# EAGLE design LEDSubMatrixHighDensity (EAGLE 9.6.2)
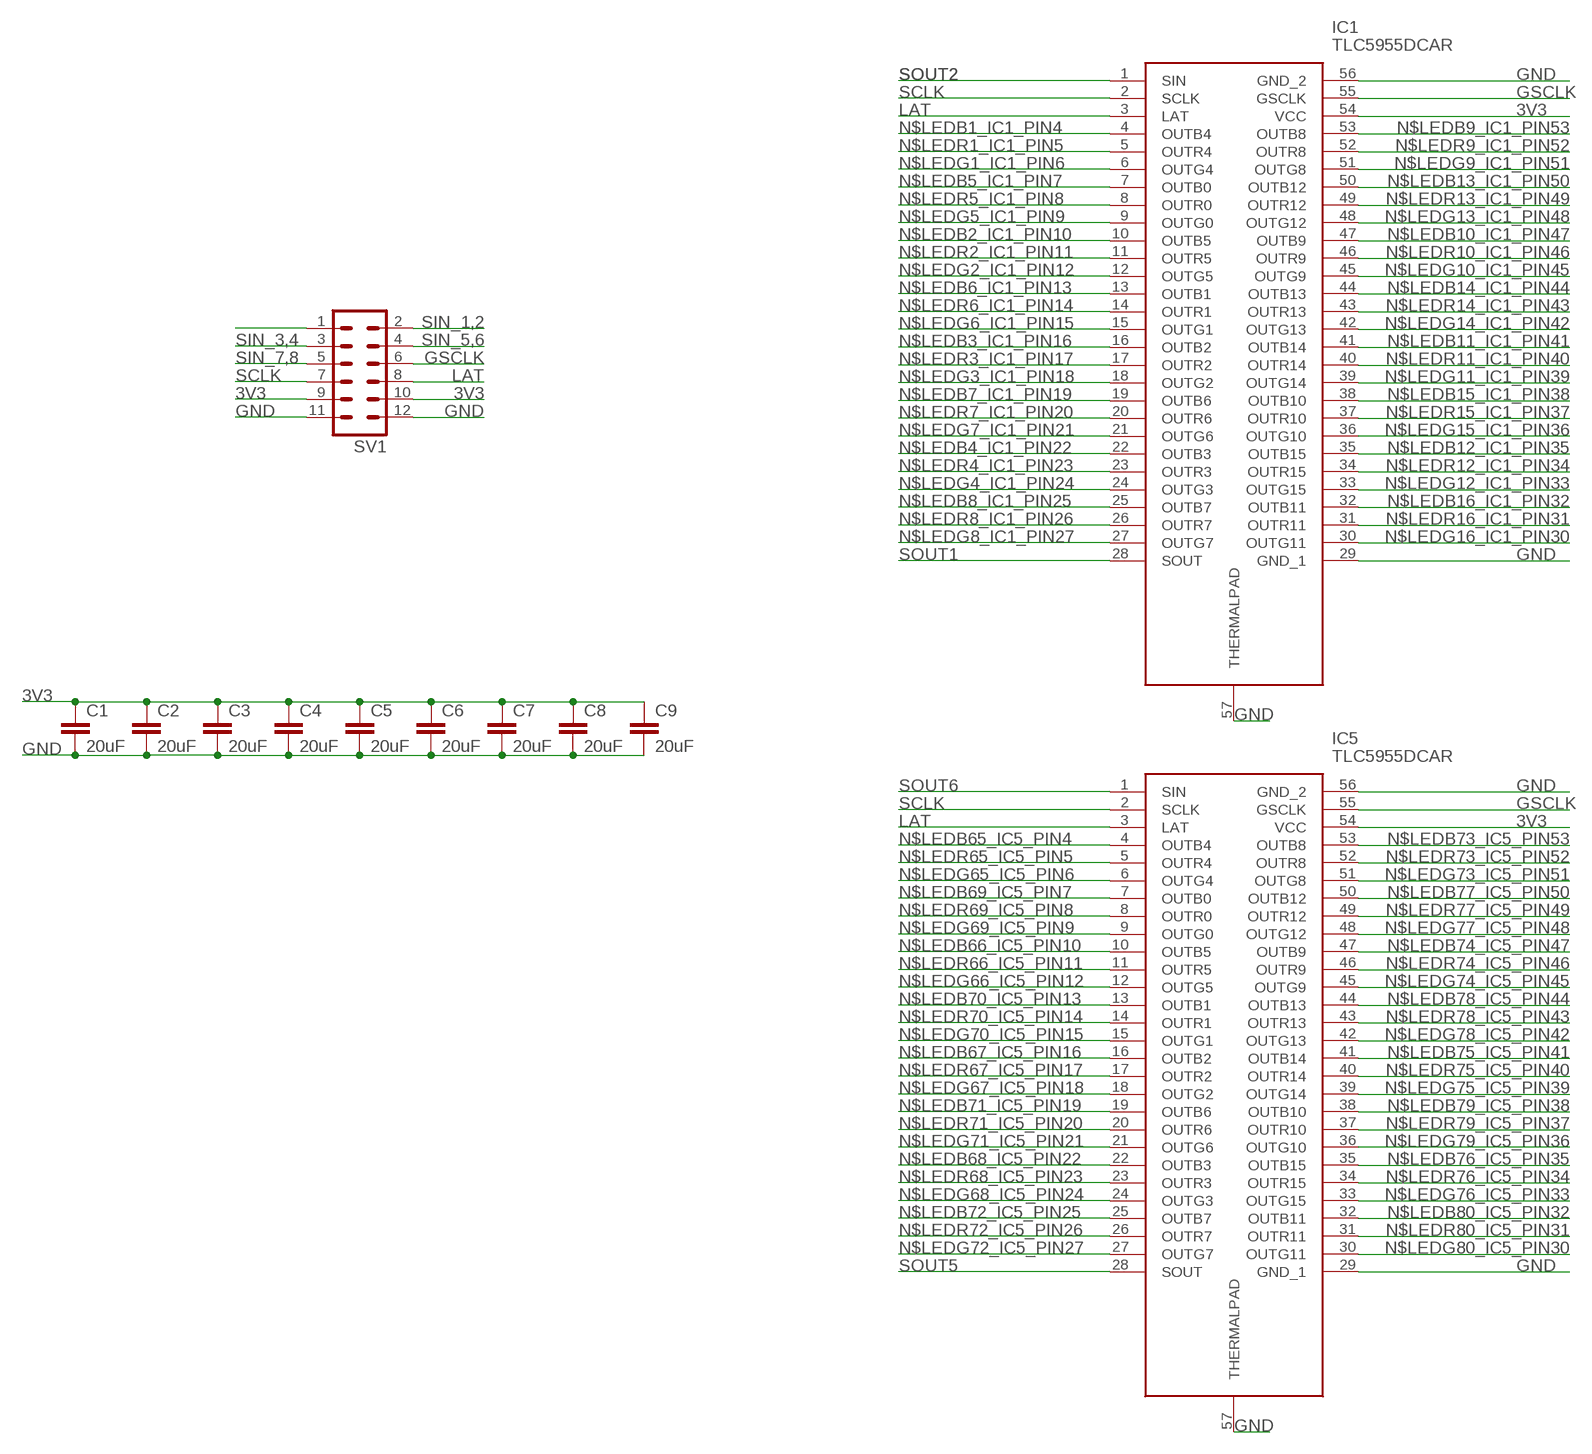
[diagram p0: schematic, sheet 1, part 1 of 3]
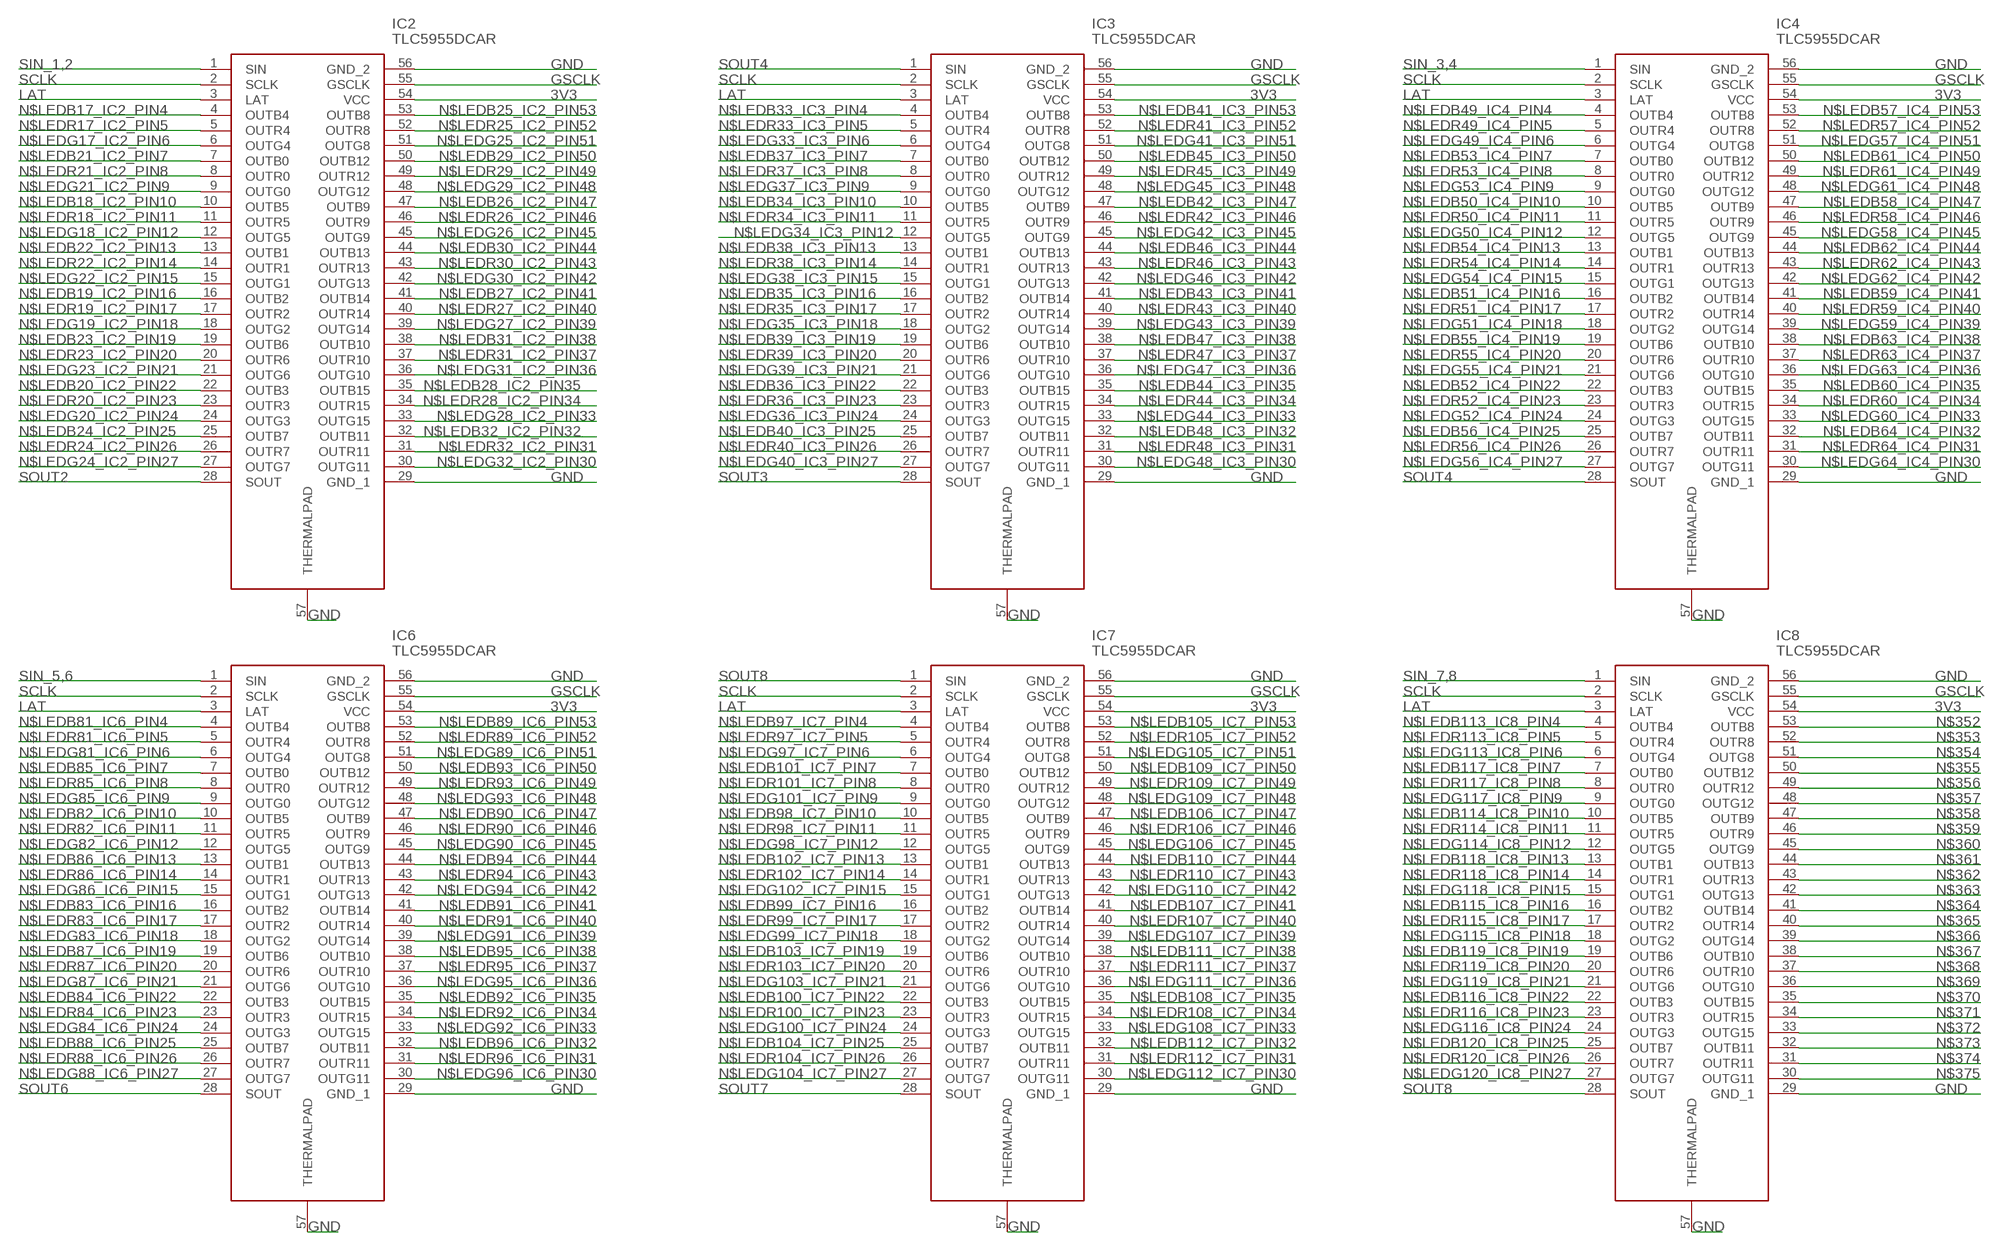
[diagram p1: schematic, sheet 1, part 2 of 3]
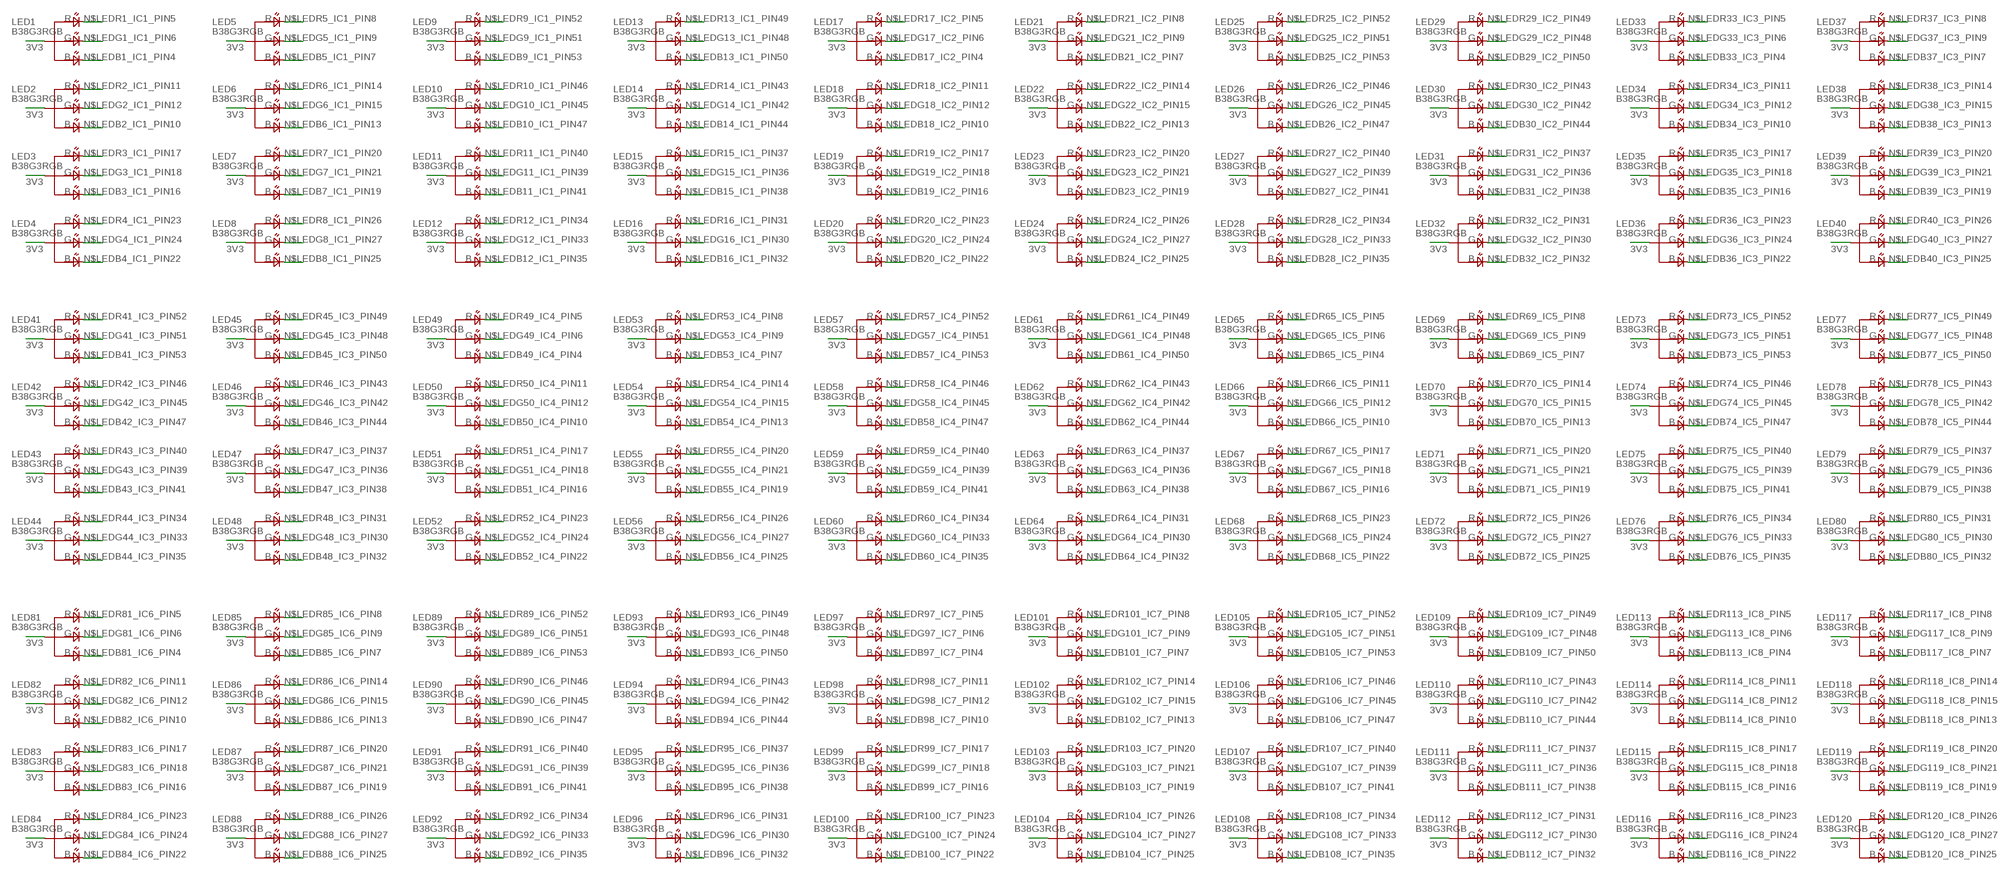
[diagram p2: schematic, sheet 1, part 3 of 3]

## Parts
C1  20uF  C-EUC0603  [C0603]
C2  20uF  C-EUC0603  [C0603]
C3  20uF  C-EUC0603  [C0603]
C4  20uF  C-EUC0603  [C0603]
C5  20uF  C-EUC0603  [C0603]
C6  20uF  C-EUC0603  [C0603]
C7  20uF  C-EUC0603  [C0603]
C8  20uF  C-EUC0603  [C0603]
C9  20uF  C-EUC0805  [C0805]
IC1  TLC5955DCAR  [SOP50P810X120-57N]
IC2  TLC5955DCAR  [SOP50P810X120-57N]
IC3  TLC5955DCAR  [SOP50P810X120-57N]
IC4  TLC5955DCAR  [SOP50P810X120-57N]
IC5  TLC5955DCAR  [SOP50P810X120-57N]
IC6  TLC5955DCAR  [SOP50P810X120-57N]
IC7  TLC5955DCAR  [SOP50P810X120-57N]
IC8  TLC5955DCAR  [SOP50P810X120-57N]
LED1  B38G3RGB  [B38G3RGB]
LED2  B38G3RGB  [B38G3RGB]
LED3  B38G3RGB  [B38G3RGB]
LED4  B38G3RGB  [B38G3RGB]
LED5  B38G3RGB  [B38G3RGB]
LED6  B38G3RGB  [B38G3RGB]
LED7  B38G3RGB  [B38G3RGB]
LED8  B38G3RGB  [B38G3RGB]
LED9  B38G3RGB  [B38G3RGB]
LED10  B38G3RGB  [B38G3RGB]
LED11  B38G3RGB  [B38G3RGB]
LED12  B38G3RGB  [B38G3RGB]
LED13  B38G3RGB  [B38G3RGB]
LED14  B38G3RGB  [B38G3RGB]
LED15  B38G3RGB  [B38G3RGB]
LED16  B38G3RGB  [B38G3RGB]
LED17  B38G3RGB  [B38G3RGB]
LED18  B38G3RGB  [B38G3RGB]
LED19  B38G3RGB  [B38G3RGB]
LED20  B38G3RGB  [B38G3RGB]
LED21  B38G3RGB  [B38G3RGB]
LED22  B38G3RGB  [B38G3RGB]
LED23  B38G3RGB  [B38G3RGB]
LED24  B38G3RGB  [B38G3RGB]
LED25  B38G3RGB  [B38G3RGB]
LED26  B38G3RGB  [B38G3RGB]
LED27  B38G3RGB  [B38G3RGB]
LED28  B38G3RGB  [B38G3RGB]
LED29  B38G3RGB  [B38G3RGB]
LED30  B38G3RGB  [B38G3RGB]
LED31  B38G3RGB  [B38G3RGB]
LED32  B38G3RGB  [B38G3RGB]
LED33  B38G3RGB  [B38G3RGB]
LED34  B38G3RGB  [B38G3RGB]
LED35  B38G3RGB  [B38G3RGB]
LED36  B38G3RGB  [B38G3RGB]
LED37  B38G3RGB  [B38G3RGB]
LED38  B38G3RGB  [B38G3RGB]
LED39  B38G3RGB  [B38G3RGB]
LED40  B38G3RGB  [B38G3RGB]
LED41  B38G3RGB  [B38G3RGB]
LED42  B38G3RGB  [B38G3RGB]
LED43  B38G3RGB  [B38G3RGB]
LED44  B38G3RGB  [B38G3RGB]
LED45  B38G3RGB  [B38G3RGB]
LED46  B38G3RGB  [B38G3RGB]
LED47  B38G3RGB  [B38G3RGB]
LED48  B38G3RGB  [B38G3RGB]
LED49  B38G3RGB  [B38G3RGB]
LED50  B38G3RGB  [B38G3RGB]
LED51  B38G3RGB  [B38G3RGB]
LED52  B38G3RGB  [B38G3RGB]
LED53  B38G3RGB  [B38G3RGB]
LED54  B38G3RGB  [B38G3RGB]
LED55  B38G3RGB  [B38G3RGB]
LED56  B38G3RGB  [B38G3RGB]
LED57  B38G3RGB  [B38G3RGB]
LED58  B38G3RGB  [B38G3RGB]
LED59  B38G3RGB  [B38G3RGB]
LED60  B38G3RGB  [B38G3RGB]
LED61  B38G3RGB  [B38G3RGB]
LED62  B38G3RGB  [B38G3RGB]
LED63  B38G3RGB  [B38G3RGB]
LED64  B38G3RGB  [B38G3RGB]
LED65  B38G3RGB  [B38G3RGB]
LED66  B38G3RGB  [B38G3RGB]
LED67  B38G3RGB  [B38G3RGB]
LED68  B38G3RGB  [B38G3RGB]
LED69  B38G3RGB  [B38G3RGB]
LED70  B38G3RGB  [B38G3RGB]
LED71  B38G3RGB  [B38G3RGB]
LED72  B38G3RGB  [B38G3RGB]
LED73  B38G3RGB  [B38G3RGB]
LED74  B38G3RGB  [B38G3RGB]
LED75  B38G3RGB  [B38G3RGB]
LED76  B38G3RGB  [B38G3RGB]
LED77  B38G3RGB  [B38G3RGB]
LED78  B38G3RGB  [B38G3RGB]
LED79  B38G3RGB  [B38G3RGB]
LED80  B38G3RGB  [B38G3RGB]
LED81  B38G3RGB  [B38G3RGB]
LED82  B38G3RGB  [B38G3RGB]
LED83  B38G3RGB  [B38G3RGB]
LED84  B38G3RGB  [B38G3RGB]
LED85  B38G3RGB  [B38G3RGB]
LED86  B38G3RGB  [B38G3RGB]
LED87  B38G3RGB  [B38G3RGB]
LED88  B38G3RGB  [B38G3RGB]
LED89  B38G3RGB  [B38G3RGB]
LED90  B38G3RGB  [B38G3RGB]
LED91  B38G3RGB  [B38G3RGB]
LED92  B38G3RGB  [B38G3RGB]
LED93  B38G3RGB  [B38G3RGB]
LED94  B38G3RGB  [B38G3RGB]
LED95  B38G3RGB  [B38G3RGB]
LED96  B38G3RGB  [B38G3RGB]
LED97  B38G3RGB  [B38G3RGB]
LED98  B38G3RGB  [B38G3RGB]
LED99  B38G3RGB  [B38G3RGB]
LED100  B38G3RGB  [B38G3RGB]
LED101  B38G3RGB  [B38G3RGB]
LED102  B38G3RGB  [B38G3RGB]
LED103  B38G3RGB  [B38G3RGB]
LED104  B38G3RGB  [B38G3RGB]
LED105  B38G3RGB  [B38G3RGB]
LED106  B38G3RGB  [B38G3RGB]
LED107  B38G3RGB  [B38G3RGB]
LED108  B38G3RGB  [B38G3RGB]
LED109  B38G3RGB  [B38G3RGB]
LED110  B38G3RGB  [B38G3RGB]
LED111  B38G3RGB  [B38G3RGB]
LED112  B38G3RGB  [B38G3RGB]
LED113  B38G3RGB  [B38G3RGB]
LED114  B38G3RGB  [B38G3RGB]
LED115  B38G3RGB  [B38G3RGB]
LED116  B38G3RGB  [B38G3RGB]
LED117  B38G3RGB  [B38G3RGB]
LED118  B38G3RGB  [B38G3RGB]
LED119  B38G3RGB  [B38G3RGB]
LED120  B38G3RGB  [B38G3RGB]
SV1  MA06-2  [MA06-2]

## Nets
3V3: C1.1 C2.1 C3.1 C4.1 C5.1 C6.1 C7.1 C8.1 C9.1 IC1.54(VCC) IC2.54(VCC) IC3.54(VCC) IC4.54(VCC) IC5.54(VCC) IC6.54(VCC) IC7.54(VCC) IC8.54(VCC) LED1.3(COM) LED2.3(COM) LED3.3(COM) LED4.3(COM) LED5.3(COM) LED6.3(COM) LED7.3(COM) LED8.3(COM) LED9.3(COM) LED10.3(COM) LED11.3(COM) LED12.3(COM) LED13.3(COM) LED14.3(COM) LED15.3(COM) LED16.3(COM) LED17.3(COM) LED18.3(COM) LED19.3(COM) LED20.3(COM) LED21.3(COM) LED22.3(COM) LED23.3(COM) LED24.3(COM) LED25.3(COM) LED26.3(COM) LED27.3(COM) LED28.3(COM) LED29.3(COM) LED30.3(COM) LED31.3(COM) LED32.3(COM) LED33.3(COM) LED34.3(COM) LED35.3(COM) LED36.3(COM) LED37.3(COM) LED38.3(COM) LED39.3(COM) LED40.3(COM) LED41.3(COM) LED42.3(COM) LED43.3(COM) LED44.3(COM) LED45.3(COM) LED46.3(COM) LED47.3(COM) LED48.3(COM) LED49.3(COM) LED50.3(COM) LED51.3(COM) LED52.3(COM) LED53.3(COM) LED54.3(COM) LED55.3(COM) LED56.3(COM) LED57.3(COM) LED58.3(COM) LED59.3(COM) LED60.3(COM) LED61.3(COM) LED62.3(COM) LED63.3(COM) LED64.3(COM) LED65.3(COM) LED66.3(COM) LED67.3(COM) LED68.3(COM) LED69.3(COM) LED70.3(COM) LED71.3(COM) LED72.3(COM) LED73.3(COM) LED74.3(COM) LED75.3(COM) LED76.3(COM) LED77.3(COM) LED78.3(COM) LED79.3(COM) LED80.3(COM) LED81.3(COM) LED82.3(COM) LED83.3(COM) LED84.3(COM) LED85.3(COM) LED86.3(COM) LED87.3(COM) LED88.3(COM) LED89.3(COM) LED90.3(COM) LED91.3(COM) LED92.3(COM) LED93.3(COM) LED94.3(COM) LED95.3(COM) LED96.3(COM) LED97.3(COM) LED98.3(COM) LED99.3(COM) LED100.3(COM) LED101.3(COM) LED102.3(COM) LED103.3(COM) LED104.3(COM) LED105.3(COM) LED106.3(COM) LED107.3(COM) LED108.3(COM) LED109.3(COM) LED110.3(COM) LED111.3(COM) LED112.3(COM) LED113.3(COM) LED114.3(COM) LED115.3(COM) LED116.3(COM) LED117.3(COM) LED118.3(COM) LED119.3(COM) LED120.3(COM) SV1.9 SV1.10
GND: C1.2 C2.2 C3.2 C4.2 C5.2 C6.2 C7.2 C8.2 C9.2 IC1.29(GND_1) IC1.56(GND_2) IC1.57(THERMALPAD) IC2.29(GND_1) IC2.56(GND_2) IC2.57(THERMALPAD) IC3.29(GND_1) IC3.56(GND_2) IC3.57(THERMALPAD) IC4.29(GND_1) IC4.56(GND_2) IC4.57(THERMALPAD) IC5.29(GND_1) IC5.56(GND_2) IC5.57(THERMALPAD) IC6.29(GND_1) IC6.56(GND_2) IC6.57(THERMALPAD) IC7.29(GND_1) IC7.56(GND_2) IC7.57(THERMALPAD) IC8.29(GND_1) IC8.56(GND_2) IC8.57(THERMALPAD) SV1.11 SV1.12
GSCLK: IC1.55(GSCLK) IC2.55(GSCLK) IC3.55(GSCLK) IC4.55(GSCLK) IC5.55(GSCLK) IC6.55(GSCLK) IC7.55(GSCLK) IC8.55(GSCLK) SV1.6
LAT: IC1.3(LAT) IC2.3(LAT) IC3.3(LAT) IC4.3(LAT) IC5.3(LAT) IC6.3(LAT) IC7.3(LAT) IC8.3(LAT) SV1.8
N$1: SV1.1
N$352: IC8.53(OUTB8)
N$353: IC8.52(OUTR8)
N$354: IC8.51(OUTG8)
N$355: IC8.50(OUTB12)
N$356: IC8.49(OUTR12)
N$357: IC8.48(OUTG12)
N$358: IC8.47(OUTB9)
N$359: IC8.46(OUTR9)
N$360: IC8.45(OUTG9)
N$361: IC8.44(OUTB13)
N$362: IC8.43(OUTR13)
N$363: IC8.42(OUTG13)
N$364: IC8.41(OUTB14)
N$365: IC8.40(OUTR14)
N$366: IC8.39(OUTG14)
N$367: IC8.38(OUTB10)
N$368: IC8.37(OUTR10)
N$369: IC8.36(OUTG10)
N$370: IC8.35(OUTB15)
N$371: IC8.34(OUTR15)
N$372: IC8.33(OUTG15)
N$373: IC8.32(OUTB11)
N$374: IC8.31(OUTR11)
N$375: IC8.30(OUTG11)
N$LEDB1_IC1_PIN4: IC1.4(OUTB4) LED1.2(BLUE)
N$LEDB2_IC1_PIN10: IC1.10(OUTB5) LED2.2(BLUE)
N$LEDB3_IC1_PIN16: IC1.16(OUTB2) LED3.2(BLUE)
N$LEDB4_IC1_PIN22: IC1.22(OUTB3) LED4.2(BLUE)
N$LEDB5_IC1_PIN7: IC1.7(OUTB0) LED5.2(BLUE)
N$LEDB6_IC1_PIN13: IC1.13(OUTB1) LED6.2(BLUE)
N$LEDB7_IC1_PIN19: IC1.19(OUTB6) LED7.2(BLUE)
N$LEDB8_IC1_PIN25: IC1.25(OUTB7) LED8.2(BLUE)
N$LEDB9_IC1_PIN53: IC1.53(OUTB8) LED9.2(BLUE)
N$LEDB10_IC1_PIN47: IC1.47(OUTB9) LED10.2(BLUE)
N$LEDB11_IC1_PIN41: IC1.41(OUTB14) LED11.2(BLUE)
N$LEDB12_IC1_PIN35: IC1.35(OUTB15) LED12.2(BLUE)
N$LEDB13_IC1_PIN50: IC1.50(OUTB12) LED13.2(BLUE)
N$LEDB14_IC1_PIN44: IC1.44(OUTB13) LED14.2(BLUE)
N$LEDB15_IC1_PIN38: IC1.38(OUTB10) LED15.2(BLUE)
N$LEDB16_IC1_PIN32: IC1.32(OUTB11) LED16.2(BLUE)
N$LEDB17_IC2_PIN4: IC2.4(OUTB4) LED17.2(BLUE)
N$LEDB18_IC2_PIN10: IC2.10(OUTB5) LED18.2(BLUE)
N$LEDB19_IC2_PIN16: IC2.16(OUTB2) LED19.2(BLUE)
N$LEDB20_IC2_PIN22: IC2.22(OUTB3) LED20.2(BLUE)
N$LEDB21_IC2_PIN7: IC2.7(OUTB0) LED21.2(BLUE)
N$LEDB22_IC2_PIN13: IC2.13(OUTB1) LED22.2(BLUE)
N$LEDB23_IC2_PIN19: IC2.19(OUTB6) LED23.2(BLUE)
N$LEDB24_IC2_PIN25: IC2.25(OUTB7) LED24.2(BLUE)
N$LEDB25_IC2_PIN53: IC2.53(OUTB8) LED25.2(BLUE)
N$LEDB26_IC2_PIN47: IC2.47(OUTB9) LED26.2(BLUE)
N$LEDB27_IC2_PIN41: IC2.41(OUTB14) LED27.2(BLUE)
N$LEDB28_IC2_PIN35: IC2.35(OUTB15) LED28.2(BLUE)
N$LEDB29_IC2_PIN50: IC2.50(OUTB12) LED29.2(BLUE)
N$LEDB30_IC2_PIN44: IC2.44(OUTB13) LED30.2(BLUE)
N$LEDB31_IC2_PIN38: IC2.38(OUTB10) LED31.2(BLUE)
N$LEDB32_IC2_PIN32: IC2.32(OUTB11) LED32.2(BLUE)
N$LEDB33_IC3_PIN4: IC3.4(OUTB4) LED33.2(BLUE)
N$LEDB34_IC3_PIN10: IC3.10(OUTB5) LED34.2(BLUE)
N$LEDB35_IC3_PIN16: IC3.16(OUTB2) LED35.2(BLUE)
N$LEDB36_IC3_PIN22: IC3.22(OUTB3) LED36.2(BLUE)
N$LEDB37_IC3_PIN7: IC3.7(OUTB0) LED37.2(BLUE)
N$LEDB38_IC3_PIN13: IC3.13(OUTB1) LED38.2(BLUE)
N$LEDB39_IC3_PIN19: IC3.19(OUTB6) LED39.2(BLUE)
N$LEDB40_IC3_PIN25: IC3.25(OUTB7) LED40.2(BLUE)
N$LEDB41_IC3_PIN53: IC3.53(OUTB8) LED41.2(BLUE)
N$LEDB42_IC3_PIN47: IC3.47(OUTB9) LED42.2(BLUE)
N$LEDB43_IC3_PIN41: IC3.41(OUTB14) LED43.2(BLUE)
N$LEDB44_IC3_PIN35: IC3.35(OUTB15) LED44.2(BLUE)
N$LEDB45_IC3_PIN50: IC3.50(OUTB12) LED45.2(BLUE)
N$LEDB46_IC3_PIN44: IC3.44(OUTB13) LED46.2(BLUE)
N$LEDB47_IC3_PIN38: IC3.38(OUTB10) LED47.2(BLUE)
N$LEDB48_IC3_PIN32: IC3.32(OUTB11) LED48.2(BLUE)
N$LEDB49_IC4_PIN4: IC4.4(OUTB4) LED49.2(BLUE)
N$LEDB50_IC4_PIN10: IC4.10(OUTB5) LED50.2(BLUE)
N$LEDB51_IC4_PIN16: IC4.16(OUTB2) LED51.2(BLUE)
N$LEDB52_IC4_PIN22: IC4.22(OUTB3) LED52.2(BLUE)
N$LEDB53_IC4_PIN7: IC4.7(OUTB0) LED53.2(BLUE)
N$LEDB54_IC4_PIN13: IC4.13(OUTB1) LED54.2(BLUE)
N$LEDB55_IC4_PIN19: IC4.19(OUTB6) LED55.2(BLUE)
N$LEDB56_IC4_PIN25: IC4.25(OUTB7) LED56.2(BLUE)
N$LEDB57_IC4_PIN53: IC4.53(OUTB8) LED57.2(BLUE)
N$LEDB58_IC4_PIN47: IC4.47(OUTB9) LED58.2(BLUE)
N$LEDB59_IC4_PIN41: IC4.41(OUTB14) LED59.2(BLUE)
N$LEDB60_IC4_PIN35: IC4.35(OUTB15) LED60.2(BLUE)
N$LEDB61_IC4_PIN50: IC4.50(OUTB12) LED61.2(BLUE)
N$LEDB62_IC4_PIN44: IC4.44(OUTB13) LED62.2(BLUE)
N$LEDB63_IC4_PIN38: IC4.38(OUTB10) LED63.2(BLUE)
N$LEDB64_IC4_PIN32: IC4.32(OUTB11) LED64.2(BLUE)
N$LEDB65_IC5_PIN4: IC5.4(OUTB4) LED65.2(BLUE)
N$LEDB66_IC5_PIN10: IC5.10(OUTB5) LED66.2(BLUE)
N$LEDB67_IC5_PIN16: IC5.16(OUTB2) LED67.2(BLUE)
N$LEDB68_IC5_PIN22: IC5.22(OUTB3) LED68.2(BLUE)
N$LEDB69_IC5_PIN7: IC5.7(OUTB0) LED69.2(BLUE)
N$LEDB70_IC5_PIN13: IC5.13(OUTB1) LED70.2(BLUE)
N$LEDB71_IC5_PIN19: IC5.19(OUTB6) LED71.2(BLUE)
N$LEDB72_IC5_PIN25: IC5.25(OUTB7) LED72.2(BLUE)
N$LEDB73_IC5_PIN53: IC5.53(OUTB8) LED73.2(BLUE)
N$LEDB74_IC5_PIN47: IC5.47(OUTB9) LED74.2(BLUE)
N$LEDB75_IC5_PIN41: IC5.41(OUTB14) LED75.2(BLUE)
N$LEDB76_IC5_PIN35: IC5.35(OUTB15) LED76.2(BLUE)
N$LEDB77_IC5_PIN50: IC5.50(OUTB12) LED77.2(BLUE)
N$LEDB78_IC5_PIN44: IC5.44(OUTB13) LED78.2(BLUE)
N$LEDB79_IC5_PIN38: IC5.38(OUTB10) LED79.2(BLUE)
N$LEDB80_IC5_PIN32: IC5.32(OUTB11) LED80.2(BLUE)
N$LEDB81_IC6_PIN4: IC6.4(OUTB4) LED81.2(BLUE)
N$LEDB82_IC6_PIN10: IC6.10(OUTB5) LED82.2(BLUE)
N$LEDB83_IC6_PIN16: IC6.16(OUTB2) LED83.2(BLUE)
N$LEDB84_IC6_PIN22: IC6.22(OUTB3) LED84.2(BLUE)
N$LEDB85_IC6_PIN7: IC6.7(OUTB0) LED85.2(BLUE)
N$LEDB86_IC6_PIN13: IC6.13(OUTB1) LED86.2(BLUE)
N$LEDB87_IC6_PIN19: IC6.19(OUTB6) LED87.2(BLUE)
N$LEDB88_IC6_PIN25: IC6.25(OUTB7) LED88.2(BLUE)
N$LEDB89_IC6_PIN53: IC6.53(OUTB8) LED89.2(BLUE)
N$LEDB90_IC6_PIN47: IC6.47(OUTB9) LED90.2(BLUE)
N$LEDB91_IC6_PIN41: IC6.41(OUTB14) LED91.2(BLUE)
N$LEDB92_IC6_PIN35: IC6.35(OUTB15) LED92.2(BLUE)
N$LEDB93_IC6_PIN50: IC6.50(OUTB12) LED93.2(BLUE)
N$LEDB94_IC6_PIN44: IC6.44(OUTB13) LED94.2(BLUE)
N$LEDB95_IC6_PIN38: IC6.38(OUTB10) LED95.2(BLUE)
N$LEDB96_IC6_PIN32: IC6.32(OUTB11) LED96.2(BLUE)
N$LEDB97_IC7_PIN4: IC7.4(OUTB4) LED97.2(BLUE)
N$LEDB98_IC7_PIN10: IC7.10(OUTB5) LED98.2(BLUE)
N$LEDB99_IC7_PIN16: IC7.16(OUTB2) LED99.2(BLUE)
N$LEDB100_IC7_PIN22: IC7.22(OUTB3) LED100.2(BLUE)
N$LEDB101_IC7_PIN7: IC7.7(OUTB0) LED101.2(BLUE)
N$LEDB102_IC7_PIN13: IC7.13(OUTB1) LED102.2(BLUE)
N$LEDB103_IC7_PIN19: IC7.19(OUTB6) LED103.2(BLUE)
N$LEDB104_IC7_PIN25: IC7.25(OUTB7) LED104.2(BLUE)
N$LEDB105_IC7_PIN53: IC7.53(OUTB8) LED105.2(BLUE)
N$LEDB106_IC7_PIN47: IC7.47(OUTB9) LED106.2(BLUE)
N$LEDB107_IC7_PIN41: IC7.41(OUTB14) LED107.2(BLUE)
N$LEDB108_IC7_PIN35: IC7.35(OUTB15) LED108.2(BLUE)
N$LEDB109_IC7_PIN50: IC7.50(OUTB12) LED109.2(BLUE)
N$LEDB110_IC7_PIN44: IC7.44(OUTB13) LED110.2(BLUE)
N$LEDB111_IC7_PIN38: IC7.38(OUTB10) LED111.2(BLUE)
N$LEDB112_IC7_PIN32: IC7.32(OUTB11) LED112.2(BLUE)
N$LEDB113_IC8_PIN4: IC8.4(OUTB4) LED113.2(BLUE)
N$LEDB114_IC8_PIN10: IC8.10(OUTB5) LED114.2(BLUE)
N$LEDB115_IC8_PIN16: IC8.16(OUTB2) LED115.2(BLUE)
N$LEDB116_IC8_PIN22: IC8.22(OUTB3) LED116.2(BLUE)
N$LEDB117_IC8_PIN7: IC8.7(OUTB0) LED117.2(BLUE)
N$LEDB118_IC8_PIN13: IC8.13(OUTB1) LED118.2(BLUE)
N$LEDB119_IC8_PIN19: IC8.19(OUTB6) LED119.2(BLUE)
N$LEDB120_IC8_PIN25: IC8.25(OUTB7) LED120.2(BLUE)
N$LEDG1_IC1_PIN6: IC1.6(OUTG4) LED1.1(GREEN)
N$LEDG2_IC1_PIN12: IC1.12(OUTG5) LED2.1(GREEN)
N$LEDG3_IC1_PIN18: IC1.18(OUTG2) LED3.1(GREEN)
N$LEDG4_IC1_PIN24: IC1.24(OUTG3) LED4.1(GREEN)
N$LEDG5_IC1_PIN9: IC1.9(OUTG0) LED5.1(GREEN)
N$LEDG6_IC1_PIN15: IC1.15(OUTG1) LED6.1(GREEN)
N$LEDG7_IC1_PIN21: IC1.21(OUTG6) LED7.1(GREEN)
N$LEDG8_IC1_PIN27: IC1.27(OUTG7) LED8.1(GREEN)
N$LEDG9_IC1_PIN51: IC1.51(OUTG8) LED9.1(GREEN)
N$LEDG10_IC1_PIN45: IC1.45(OUTG9) LED10.1(GREEN)
N$LEDG11_IC1_PIN39: IC1.39(OUTG14) LED11.1(GREEN)
N$LEDG12_IC1_PIN33: IC1.33(OUTG15) LED12.1(GREEN)
N$LEDG13_IC1_PIN48: IC1.48(OUTG12) LED13.1(GREEN)
N$LEDG14_IC1_PIN42: IC1.42(OUTG13) LED14.1(GREEN)
N$LEDG15_IC1_PIN36: IC1.36(OUTG10) LED15.1(GREEN)
N$LEDG16_IC1_PIN30: IC1.30(OUTG11) LED16.1(GREEN)
N$LEDG17_IC2_PIN6: IC2.6(OUTG4) LED17.1(GREEN)
N$LEDG18_IC2_PIN12: IC2.12(OUTG5) LED18.1(GREEN)
N$LEDG19_IC2_PIN18: IC2.18(OUTG2) LED19.1(GREEN)
N$LEDG20_IC2_PIN24: IC2.24(OUTG3) LED20.1(GREEN)
N$LEDG21_IC2_PIN9: IC2.9(OUTG0) LED21.1(GREEN)
N$LEDG22_IC2_PIN15: IC2.15(OUTG1) LED22.1(GREEN)
N$LEDG23_IC2_PIN21: IC2.21(OUTG6) LED23.1(GREEN)
N$LEDG24_IC2_PIN27: IC2.27(OUTG7) LED24.1(GREEN)
N$LEDG25_IC2_PIN51: IC2.51(OUTG8) LED25.1(GREEN)
N$LEDG26_IC2_PIN45: IC2.45(OUTG9) LED26.1(GREEN)
N$LEDG27_IC2_PIN39: IC2.39(OUTG14) LED27.1(GREEN)
N$LEDG28_IC2_PIN33: IC2.33(OUTG15) LED28.1(GREEN)
N$LEDG29_IC2_PIN48: IC2.48(OUTG12) LED29.1(GREEN)
N$LEDG30_IC2_PIN42: IC2.42(OUTG13) LED30.1(GREEN)
N$LEDG31_IC2_PIN36: IC2.36(OUTG10) LED31.1(GREEN)
N$LEDG32_IC2_PIN30: IC2.30(OUTG11) LED32.1(GREEN)
N$LEDG33_IC3_PIN6: IC3.6(OUTG4) LED33.1(GREEN)
N$LEDG34_IC3_PIN12: IC3.12(OUTG5) LED34.1(GREEN)
N$LEDG35_IC3_PIN18: IC3.18(OUTG2) LED35.1(GREEN)
N$LEDG36_IC3_PIN24: IC3.24(OUTG3) LED36.1(GREEN)
N$LEDG37_IC3_PIN9: IC3.9(OUTG0) LED37.1(GREEN)
N$LEDG38_IC3_PIN15: IC3.15(OUTG1) LED38.1(GREEN)
N$LEDG39_IC3_PIN21: IC3.21(OUTG6) LED39.1(GREEN)
N$LEDG40_IC3_PIN27: IC3.27(OUTG7) LED40.1(GREEN)
N$LEDG41_IC3_PIN51: IC3.51(OUTG8) LED41.1(GREEN)
N$LEDG42_IC3_PIN45: IC3.45(OUTG9) LED42.1(GREEN)
N$LEDG43_IC3_PIN39: IC3.39(OUTG14) LED43.1(GREEN)
N$LEDG44_IC3_PIN33: IC3.33(OUTG15) LED44.1(GREEN)
N$LEDG45_IC3_PIN48: IC3.48(OUTG12) LED45.1(GREEN)
N$LEDG46_IC3_PIN42: IC3.42(OUTG13) LED46.1(GREEN)
N$LEDG47_IC3_PIN36: IC3.36(OUTG10) LED47.1(GREEN)
N$LEDG48_IC3_PIN30: IC3.30(OUTG11) LED48.1(GREEN)
N$LEDG49_IC4_PIN6: IC4.6(OUTG4) LED49.1(GREEN)
N$LEDG50_IC4_PIN12: IC4.12(OUTG5) LED50.1(GREEN)
N$LEDG51_IC4_PIN18: IC4.18(OUTG2) LED51.1(GREEN)
N$LEDG52_IC4_PIN24: IC4.24(OUTG3) LED52.1(GREEN)
N$LEDG53_IC4_PIN9: IC4.9(OUTG0) LED53.1(GREEN)
N$LEDG54_IC4_PIN15: IC4.15(OUTG1) LED54.1(GREEN)
N$LEDG55_IC4_PIN21: IC4.21(OUTG6) LED55.1(GREEN)
N$LEDG56_IC4_PIN27: IC4.27(OUTG7) LED56.1(GREEN)
N$LEDG57_IC4_PIN51: IC4.51(OUTG8) LED57.1(GREEN)
N$LEDG58_IC4_PIN45: IC4.45(OUTG9) LED58.1(GREEN)
N$LEDG59_IC4_PIN39: IC4.39(OUTG14) LED59.1(GREEN)
N$LEDG60_IC4_PIN33: IC4.33(OUTG15) LED60.1(GREEN)
N$LEDG61_IC4_PIN48: IC4.48(OUTG12) LED61.1(GREEN)
N$LEDG62_IC4_PIN42: IC4.42(OUTG13) LED62.1(GREEN)
N$LEDG63_IC4_PIN36: IC4.36(OUTG10) LED63.1(GREEN)
N$LEDG64_IC4_PIN30: IC4.30(OUTG11) LED64.1(GREEN)
N$LEDG65_IC5_PIN6: IC5.6(OUTG4) LED65.1(GREEN)
N$LEDG66_IC5_PIN12: IC5.12(OUTG5) LED66.1(GREEN)
N$LEDG67_IC5_PIN18: IC5.18(OUTG2) LED67.1(GREEN)
N$LEDG68_IC5_PIN24: IC5.24(OUTG3) LED68.1(GREEN)
N$LEDG69_IC5_PIN9: IC5.9(OUTG0) LED69.1(GREEN)
N$LEDG70_IC5_PIN15: IC5.15(OUTG1) LED70.1(GREEN)
N$LEDG71_IC5_PIN21: IC5.21(OUTG6) LED71.1(GREEN)
N$LEDG72_IC5_PIN27: IC5.27(OUTG7) LED72.1(GREEN)
N$LEDG73_IC5_PIN51: IC5.51(OUTG8) LED73.1(GREEN)
N$LEDG74_IC5_PIN45: IC5.45(OUTG9) LED74.1(GREEN)
N$LEDG75_IC5_PIN39: IC5.39(OUTG14) LED75.1(GREEN)
N$LEDG76_IC5_PIN33: IC5.33(OUTG15) LED76.1(GREEN)
N$LEDG77_IC5_PIN48: IC5.48(OUTG12) LED77.1(GREEN)
N$LEDG78_IC5_PIN42: IC5.42(OUTG13) LED78.1(GREEN)
N$LEDG79_IC5_PIN36: IC5.36(OUTG10) LED79.1(GREEN)
N$LEDG80_IC5_PIN30: IC5.30(OUTG11) LED80.1(GREEN)
N$LEDG81_IC6_PIN6: IC6.6(OUTG4) LED81.1(GREEN)
N$LEDG82_IC6_PIN12: IC6.12(OUTG5) LED82.1(GREEN)
N$LEDG83_IC6_PIN18: IC6.18(OUTG2) LED83.1(GREEN)
N$LEDG84_IC6_PIN24: IC6.24(OUTG3) LED84.1(GREEN)
N$LEDG85_IC6_PIN9: IC6.9(OUTG0) LED85.1(GREEN)
N$LEDG86_IC6_PIN15: IC6.15(OUTG1) LED86.1(GREEN)
N$LEDG87_IC6_PIN21: IC6.21(OUTG6) LED87.1(GREEN)
N$LEDG88_IC6_PIN27: IC6.27(OUTG7) LED88.1(GREEN)
N$LEDG89_IC6_PIN51: IC6.51(OUTG8) LED89.1(GREEN)
N$LEDG90_IC6_PIN45: IC6.45(OUTG9) LED90.1(GREEN)
N$LEDG91_IC6_PIN39: IC6.39(OUTG14) LED91.1(GREEN)
N$LEDG92_IC6_PIN33: IC6.33(OUTG15) LED92.1(GREEN)
N$LEDG93_IC6_PIN48: IC6.48(OUTG12) LED93.1(GREEN)
N$LEDG94_IC6_PIN42: IC6.42(OUTG13) LED94.1(GREEN)
N$LEDG95_IC6_PIN36: IC6.36(OUTG10) LED95.1(GREEN)
N$LEDG96_IC6_PIN30: IC6.30(OUTG11) LED96.1(GREEN)
N$LEDG97_IC7_PIN6: IC7.6(OUTG4) LED97.1(GREEN)
N$LEDG98_IC7_PIN12: IC7.12(OUTG5) LED98.1(GREEN)
N$LEDG99_IC7_PIN18: IC7.18(OUTG2) LED99.1(GREEN)
N$LEDG100_IC7_PIN24: IC7.24(OUTG3) LED100.1(GREEN)
N$LEDG101_IC7_PIN9: IC7.9(OUTG0) LED101.1(GREEN)
N$LEDG102_IC7_PIN15: IC7.15(OUTG1) LED102.1(GREEN)
N$LEDG103_IC7_PIN21: IC7.21(OUTG6) LED103.1(GREEN)
N$LEDG104_IC7_PIN27: IC7.27(OUTG7) LED104.1(GREEN)
N$LEDG105_IC7_PIN51: IC7.51(OUTG8) LED105.1(GREEN)
N$LEDG106_IC7_PIN45: IC7.45(OUTG9) LED106.1(GREEN)
N$LEDG107_IC7_PIN39: IC7.39(OUTG14) LED107.1(GREEN)
N$LEDG108_IC7_PIN33: IC7.33(OUTG15) LED108.1(GREEN)
N$LEDG109_IC7_PIN48: IC7.48(OUTG12) LED109.1(GREEN)
N$LEDG110_IC7_PIN42: IC7.42(OUTG13) LED110.1(GREEN)
N$LEDG111_IC7_PIN36: IC7.36(OUTG10) LED111.1(GREEN)
N$LEDG112_IC7_PIN30: IC7.30(OUTG11) LED112.1(GREEN)
N$LEDG113_IC8_PIN6: IC8.6(OUTG4) LED113.1(GREEN)
N$LEDG114_IC8_PIN12: IC8.12(OUTG5) LED114.1(GREEN)
N$LEDG115_IC8_PIN18: IC8.18(OUTG2) LED115.1(GREEN)
N$LEDG116_IC8_PIN24: IC8.24(OUTG3) LED116.1(GREEN)
N$LEDG117_IC8_PIN9: IC8.9(OUTG0) LED117.1(GREEN)
N$LEDG118_IC8_PIN15: IC8.15(OUTG1) LED118.1(GREEN)
N$LEDG119_IC8_PIN21: IC8.21(OUTG6) LED119.1(GREEN)
N$LEDG120_IC8_PIN27: IC8.27(OUTG7) LED120.1(GREEN)
N$LEDR1_IC1_PIN5: IC1.5(OUTR4) LED1.4(RED)
N$LEDR2_IC1_PIN11: IC1.11(OUTR5) LED2.4(RED)
N$LEDR3_IC1_PIN17: IC1.17(OUTR2) LED3.4(RED)
N$LEDR4_IC1_PIN23: IC1.23(OUTR3) LED4.4(RED)
N$LEDR5_IC1_PIN8: IC1.8(OUTR0) LED5.4(RED)
N$LEDR6_IC1_PIN14: IC1.14(OUTR1) LED6.4(RED)
N$LEDR7_IC1_PIN20: IC1.20(OUTR6) LED7.4(RED)
N$LEDR8_IC1_PIN26: IC1.26(OUTR7) LED8.4(RED)
N$LEDR9_IC1_PIN52: IC1.52(OUTR8) LED9.4(RED)
N$LEDR10_IC1_PIN46: IC1.46(OUTR9) LED10.4(RED)
N$LEDR11_IC1_PIN40: IC1.40(OUTR14) LED11.4(RED)
N$LEDR12_IC1_PIN34: IC1.34(OUTR15) LED12.4(RED)
N$LEDR13_IC1_PIN49: IC1.49(OUTR12) LED13.4(RED)
N$LEDR14_IC1_PIN43: IC1.43(OUTR13) LED14.4(RED)
N$LEDR15_IC1_PIN37: IC1.37(OUTR10) LED15.4(RED)
N$LEDR16_IC1_PIN31: IC1.31(OUTR11) LED16.4(RED)
N$LEDR17_IC2_PIN5: IC2.5(OUTR4) LED17.4(RED)
N$LEDR18_IC2_PIN11: IC2.11(OUTR5) LED18.4(RED)
N$LEDR19_IC2_PIN17: IC2.17(OUTR2) LED19.4(RED)
N$LEDR20_IC2_PIN23: IC2.23(OUTR3) LED20.4(RED)
N$LEDR21_IC2_PIN8: IC2.8(OUTR0) LED21.4(RED)
N$LEDR22_IC2_PIN14: IC2.14(OUTR1) LED22.4(RED)
N$LEDR23_IC2_PIN20: IC2.20(OUTR6) LED23.4(RED)
N$LEDR24_IC2_PIN26: IC2.26(OUTR7) LED24.4(RED)
N$LEDR25_IC2_PIN52: IC2.52(OUTR8) LED25.4(RED)
N$LEDR26_IC2_PIN46: IC2.46(OUTR9) LED26.4(RED)
N$LEDR27_IC2_PIN40: IC2.40(OUTR14) LED27.4(RED)
N$LEDR28_IC2_PIN34: IC2.34(OUTR15) LED28.4(RED)
N$LEDR29_IC2_PIN49: IC2.49(OUTR12) LED29.4(RED)
N$LEDR30_IC2_PIN43: IC2.43(OUTR13) LED30.4(RED)
N$LEDR31_IC2_PIN37: IC2.37(OUTR10) LED31.4(RED)
N$LEDR32_IC2_PIN31: IC2.31(OUTR11) LED32.4(RED)
N$LEDR33_IC3_PIN5: IC3.5(OUTR4) LED33.4(RED)
N$LEDR34_IC3_PIN11: IC3.11(OUTR5) LED34.4(RED)
N$LEDR35_IC3_PIN17: IC3.17(OUTR2) LED35.4(RED)
N$LEDR36_IC3_PIN23: IC3.23(OUTR3) LED36.4(RED)
N$LEDR37_IC3_PIN8: IC3.8(OUTR0) LED37.4(RED)
N$LEDR38_IC3_PIN14: IC3.14(OUTR1) LED38.4(RED)
N$LEDR39_IC3_PIN20: IC3.20(OUTR6) LED39.4(RED)
N$LEDR40_IC3_PIN26: IC3.26(OUTR7) LED40.4(RED)
N$LEDR41_IC3_PIN52: IC3.52(OUTR8) LED41.4(RED)
N$LEDR42_IC3_PIN46: IC3.46(OUTR9) LED42.4(RED)
N$LEDR43_IC3_PIN40: IC3.40(OUTR14) LED43.4(RED)
N$LEDR44_IC3_PIN34: IC3.34(OUTR15) LED44.4(RED)
N$LEDR45_IC3_PIN49: IC3.49(OUTR12) LED45.4(RED)
N$LEDR46_IC3_PIN43: IC3.43(OUTR13) LED46.4(RED)
N$LEDR47_IC3_PIN37: IC3.37(OUTR10) LED47.4(RED)
N$LEDR48_IC3_PIN31: IC3.31(OUTR11) LED48.4(RED)
N$LEDR49_IC4_PIN5: IC4.5(OUTR4) LED49.4(RED)
N$LEDR50_IC4_PIN11: IC4.11(OUTR5) LED50.4(RED)
N$LEDR51_IC4_PIN17: IC4.17(OUTR2) LED51.4(RED)
N$LEDR52_IC4_PIN23: IC4.23(OUTR3) LED52.4(RED)
N$LEDR53_IC4_PIN8: IC4.8(OUTR0) LED53.4(RED)
N$LEDR54_IC4_PIN14: IC4.14(OUTR1) LED54.4(RED)
N$LEDR55_IC4_PIN20: IC4.20(OUTR6) LED55.4(RED)
N$LEDR56_IC4_PIN26: IC4.26(OUTR7) LED56.4(RED)
N$LEDR57_IC4_PIN52: IC4.52(OUTR8) LED57.4(RED)
N$LEDR58_IC4_PIN46: IC4.46(OUTR9) LED58.4(RED)
N$LEDR59_IC4_PIN40: IC4.40(OUTR14) LED59.4(RED)
N$LEDR60_IC4_PIN34: IC4.34(OUTR15) LED60.4(RED)
N$LEDR61_IC4_PIN49: IC4.49(OUTR12) LED61.4(RED)
N$LEDR62_IC4_PIN43: IC4.43(OUTR13) LED62.4(RED)
N$LEDR63_IC4_PIN37: IC4.37(OUTR10) LED63.4(RED)
N$LEDR64_IC4_PIN31: IC4.31(OUTR11) LED64.4(RED)
N$LEDR65_IC5_PIN5: IC5.5(OUTR4) LED65.4(RED)
N$LEDR66_IC5_PIN11: IC5.11(OUTR5) LED66.4(RED)
N$LEDR67_IC5_PIN17: IC5.17(OUTR2) LED67.4(RED)
N$LEDR68_IC5_PIN23: IC5.23(OUTR3) LED68.4(RED)
N$LEDR69_IC5_PIN8: IC5.8(OUTR0) LED69.4(RED)
N$LEDR70_IC5_PIN14: IC5.14(OUTR1) LED70.4(RED)
N$LEDR71_IC5_PIN20: IC5.20(OUTR6) LED71.4(RED)
N$LEDR72_IC5_PIN26: IC5.26(OUTR7) LED72.4(RED)
N$LEDR73_IC5_PIN52: IC5.52(OUTR8) LED73.4(RED)
N$LEDR74_IC5_PIN46: IC5.46(OUTR9) LED74.4(RED)
N$LEDR75_IC5_PIN40: IC5.40(OUTR14) LED75.4(RED)
N$LEDR76_IC5_PIN34: IC5.34(OUTR15) LED76.4(RED)
N$LEDR77_IC5_PIN49: IC5.49(OUTR12) LED77.4(RED)
N$LEDR78_IC5_PIN43: IC5.43(OUTR13) LED78.4(RED)
N$LEDR79_IC5_PIN37: IC5.37(OUTR10) LED79.4(RED)
N$LEDR80_IC5_PIN31: IC5.31(OUTR11) LED80.4(RED)
N$LEDR81_IC6_PIN5: IC6.5(OUTR4) LED81.4(RED)
N$LEDR82_IC6_PIN11: IC6.11(OUTR5) LED82.4(RED)
N$LEDR83_IC6_PIN17: IC6.17(OUTR2) LED83.4(RED)
N$LEDR84_IC6_PIN23: IC6.23(OUTR3) LED84.4(RED)
N$LEDR85_IC6_PIN8: IC6.8(OUTR0) LED85.4(RED)
N$LEDR86_IC6_PIN14: IC6.14(OUTR1) LED86.4(RED)
N$LEDR87_IC6_PIN20: IC6.20(OUTR6) LED87.4(RED)
N$LEDR88_IC6_PIN26: IC6.26(OUTR7) LED88.4(RED)
N$LEDR89_IC6_PIN52: IC6.52(OUTR8) LED89.4(RED)
N$LEDR90_IC6_PIN46: IC6.46(OUTR9) LED90.4(RED)
N$LEDR91_IC6_PIN40: IC6.40(OUTR14) LED91.4(RED)
N$LEDR92_IC6_PIN34: IC6.34(OUTR15) LED92.4(RED)
N$LEDR93_IC6_PIN49: IC6.49(OUTR12) LED93.4(RED)
N$LEDR94_IC6_PIN43: IC6.43(OUTR13) LED94.4(RED)
N$LEDR95_IC6_PIN37: IC6.37(OUTR10) LED95.4(RED)
N$LEDR96_IC6_PIN31: IC6.31(OUTR11) LED96.4(RED)
N$LEDR97_IC7_PIN5: IC7.5(OUTR4) LED97.4(RED)
N$LEDR98_IC7_PIN11: IC7.11(OUTR5) LED98.4(RED)
N$LEDR99_IC7_PIN17: IC7.17(OUTR2) LED99.4(RED)
N$LEDR100_IC7_PIN23: IC7.23(OUTR3) LED100.4(RED)
N$LEDR101_IC7_PIN8: IC7.8(OUTR0) LED101.4(RED)
N$LEDR102_IC7_PIN14: IC7.14(OUTR1) LED102.4(RED)
N$LEDR103_IC7_PIN20: IC7.20(OUTR6) LED103.4(RED)
N$LEDR104_IC7_PIN26: IC7.26(OUTR7) LED104.4(RED)
N$LEDR105_IC7_PIN52: IC7.52(OUTR8) LED105.4(RED)
N$LEDR106_IC7_PIN46: IC7.46(OUTR9) LED106.4(RED)
N$LEDR107_IC7_PIN40: IC7.40(OUTR14) LED107.4(RED)
N$LEDR108_IC7_PIN34: IC7.34(OUTR15) LED108.4(RED)
N$LEDR109_IC7_PIN49: IC7.49(OUTR12) LED109.4(RED)
N$LEDR110_IC7_PIN43: IC7.43(OUTR13) LED110.4(RED)
N$LEDR111_IC7_PIN37: IC7.37(OUTR10) LED111.4(RED)
N$LEDR112_IC7_PIN31: IC7.31(OUTR11) LED112.4(RED)
N$LEDR113_IC8_PIN5: IC8.5(OUTR4) LED113.4(RED)
N$LEDR114_IC8_PIN11: IC8.11(OUTR5) LED114.4(RED)
N$LEDR115_IC8_PIN17: IC8.17(OUTR2) LED115.4(RED)
N$LEDR116_IC8_PIN23: IC8.23(OUTR3) LED116.4(RED)
N$LEDR117_IC8_PIN8: IC8.8(OUTR0) LED117.4(RED)
N$LEDR118_IC8_PIN14: IC8.14(OUTR1) LED118.4(RED)
N$LEDR119_IC8_PIN20: IC8.20(OUTR6) LED119.4(RED)
N$LEDR120_IC8_PIN26: IC8.26(OUTR7) LED120.4(RED)
SCLK: IC1.2(SCLK) IC2.2(SCLK) IC3.2(SCLK) IC4.2(SCLK) IC5.2(SCLK) IC6.2(SCLK) IC7.2(SCLK) IC8.2(SCLK) SV1.7
SIN_1,2: IC2.1(SIN) SV1.2
SIN_3,4: IC4.1(SIN) SV1.3
SIN_5,6: IC6.1(SIN) SV1.4
SIN_7,8: IC8.1(SIN) SV1.5
SOUT1: IC1.28(SOUT)
SOUT2: IC1.1(SIN) IC2.28(SOUT)
SOUT3: IC3.28(SOUT)
SOUT4: IC3.1(SIN) IC4.28(SOUT)
SOUT5: IC5.28(SOUT)
SOUT6: IC5.1(SIN) IC6.28(SOUT)
SOUT7: IC7.28(SOUT)
SOUT8: IC7.1(SIN) IC8.28(SOUT)

## Library data of the parts
C1-C9 = rcl:C-EU: CAPACITOR, European symbol; SPICEPREFIX: C
IC1-IC8 = TLC5955DCAR:TLC5955DCAR: 48ch, 16bit PWM LED Driver with Dot-Correction, Brightness Control, Open/Short Detection Source: Datasheet <http://www.ti.com/lit/ds/symlink/tlc5955.pdf>; ARROW_PART_NUMBER: TLC5955DCAR; ARROW_PRICE-STOCK: https://www.arrow.com/en/products/tlc5955dcar/texas-instruments; DESCRIPTION: 48ch, 16bit PWM LED Driver with Dot-Correction, Brightness Control, Open/Short Detection; HEIGHT: 1.2mm; MANUFACTURER_NAME: Texas Instruments; MANUFACTURER_PART_NUMBER: TLC5955DCAR; MOUSER_PART_NUMBER: 595-TLC5955DCAR; MOUSER_PRICE-STOCK: https://www.mouser.co.uk/ProductDetail/Texas-Instruments/TLC5955DCAR?qs=%2Fd%252BFzHvH4c3zo%2FeGYG5n7g%3D%3D
LED1-LED120 = B38G3RGB:B38G3RGB: Standard LEDs - SMD Surface Mount LEDs Source: Datasheet <https://www.arrow.com/en/products/sml-lx0606igc-tr/lumex>; ARROW_PART_NUMBER: SML-LX0606IGC-TR; ARROW_PRICE-STOCK: https://www.arrow.com/en/products/sml-lx0606igc-tr/lumex; DESCRIPTION: Standard LEDs - SMD Surface Mount LEDs; HEIGHT: 0.7mm; MANUFACTURER_NAME: Lumex; MANUFACTURER_PART_NUMBER: SML-LX0606IGC-TR; MOUSER_PART_NUMBER: 696-SML-0606IGCTR; MOUSER_PRICE-STOCK: https://www.mouser.co.uk/ProductDetail/Lumex/SML-LX0606IGC-TR?qs=I1ILoAvtKy%252BVd7WFwiUkZQ%3D%3D
SV1 = con-lstb:MA06-2: PIN HEADER; OC_FARNELL: unknown; OC_NEWARK: unknown

## Board
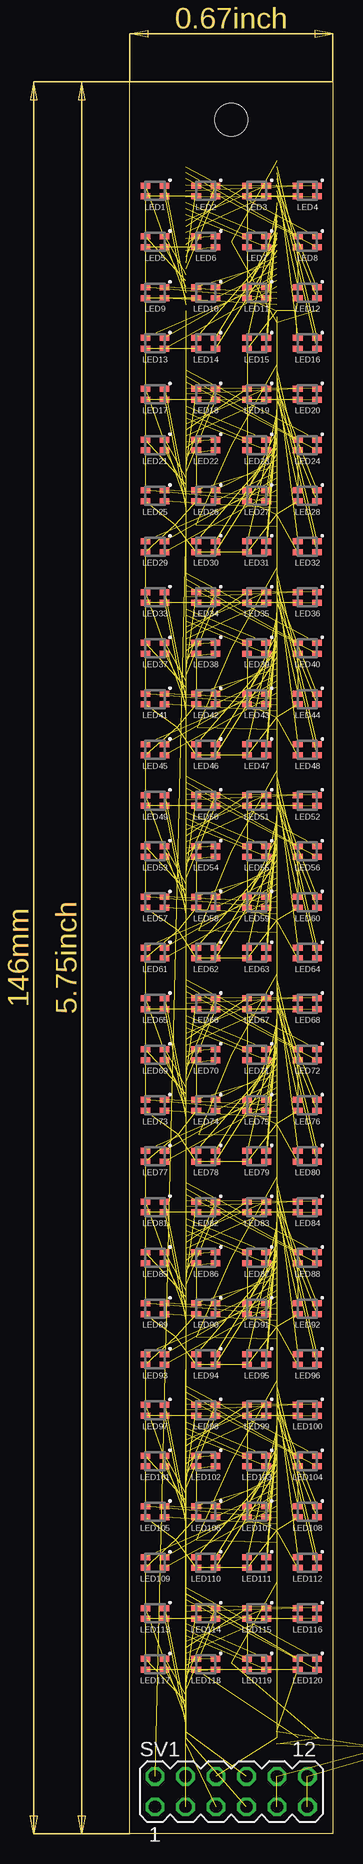
[diagram p3: board, top side]
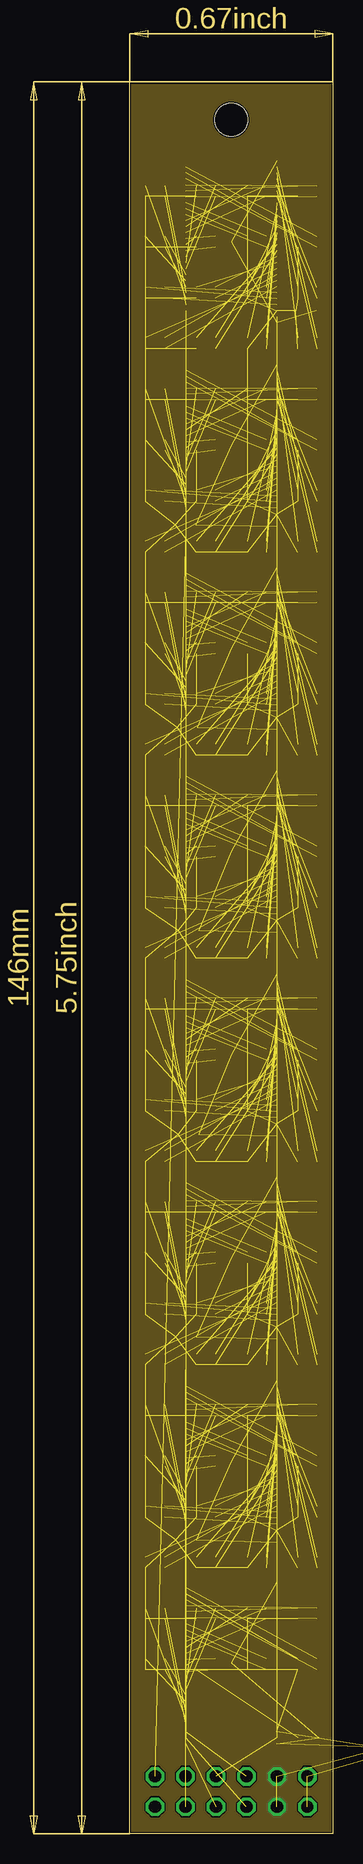
[diagram p4: board, inner layer InnerTop]
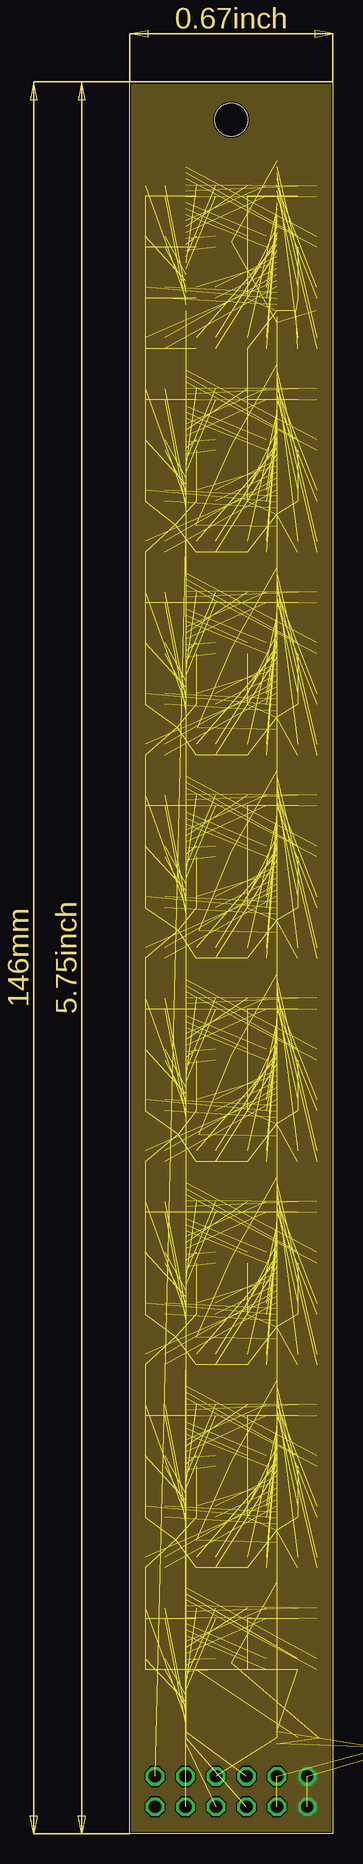
[diagram p5: board, inner layer InnerBottom]
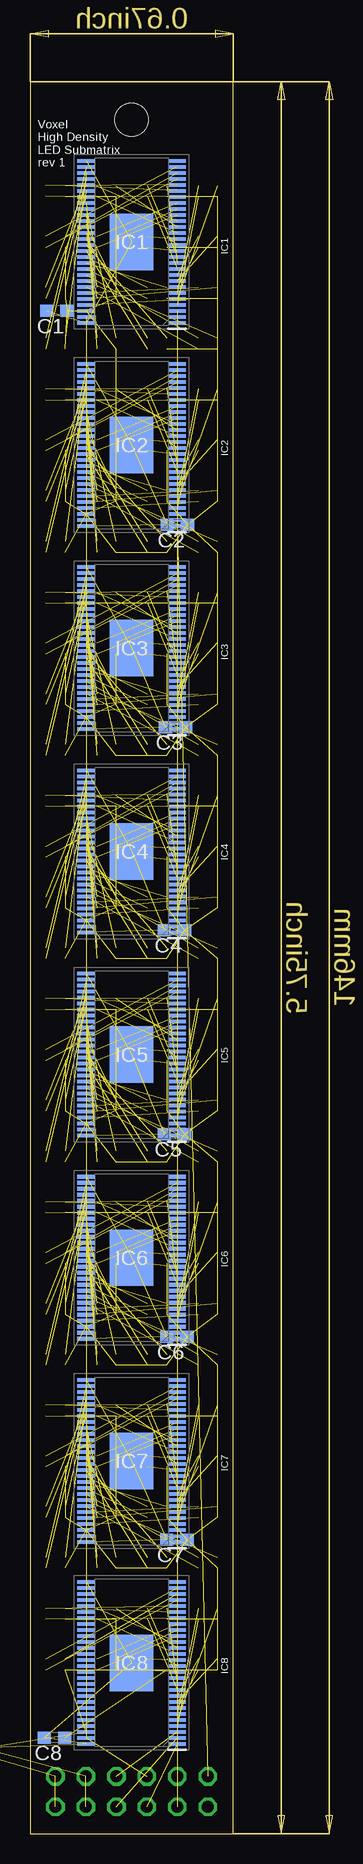
[diagram p6: board, bottom side, seen from below]

Size 16.93 x 146 mm. Coordinates in mm from the lower left corner, seen from the top.
Outline: 0,146 16.93,146 16.93,0 0,0 0,146
Copper layers (1+2*15+16): Top 0.035mm / dielectric 0.2mm / InnerTop 0.0175mm / dielectric 1.065mm / InnerBottom 0.0175mm / dielectric 0.2mm / Bottom 0.035mm
Design rules "jlcpcb_4layer_1oz": minimum track width 5mil, minimum drill 0.2mm, track to track 5mil, track to pad 0.2mm, pad to pad 5mil, via to via 6mil, smd to smd 5mil, copper to edge 5mil, drill to drill 0.5mm, minimum pad ring 10mil, minimum via ring 0.1mm, stop-mask expansion 4mil, vias tented up to drill 0mil, thermal gap 10mil
Holes 2.75 mm at 8.47,142.82

### Footprints (pad centres in the part's own frame; a part is rotated, then mirrored left to right if it is on the bottom)
C0603 = smd 1.1 x 1: 1 -0.85,0; 2 0.85,0
C0805 = smd 1.3 x 1.5: 1 -0.95,0; 2 0.95,0
SOP50P810X120-57N = smd 1.475 x 0.3: 1 -3.788,6.75; 2 -3.788,6.25; 3 -3.788,5.75; 4 -3.788,5.25; 5 -3.788,4.75; 6 -3.788,4.25; 7 -3.788,3.75; 8 -3.788,3.25; 9 -3.788,2.75; 10 -3.788,2.25; 11 -3.788,1.75; 12 -3.788,1.25; 13 -3.788,0.75; 14 -3.788,0.25; 15 -3.788,-0.25; 16 -3.788,-0.75; 17 -3.788,-1.25; 18 -3.788,-1.75; 19 -3.788,-2.25; 20 -3.788,-2.75; 21 -3.788,-3.25; 22 -3.788,-3.75; 23 -3.788,-4.25; 24 -3.788,-4.75; 25 -3.788,-5.25; 26 -3.788,-5.75; 27 -3.788,-6.25; 28 -3.788,-6.75; 29 3.788,-6.75; 30 3.788,-6.25; 31 3.788,-5.75; 32 3.788,-5.25; 33 3.788,-4.75; 34 3.788,-4.25; 35 3.788,-3.75; 36 3.788,-3.25; 37 3.788,-2.75; 38 3.788,-2.25; 39 3.788,-1.75; 40 3.788,-1.25; 41 3.788,-0.75; 42 3.788,-0.25; 43 3.788,0.25; 44 3.788,0.75; 45 3.788,1.25; 46 3.788,1.75; 47 3.788,2.25; 48 3.788,2.75; 49 3.788,3.25; 50 3.788,3.75; 51 3.788,4.25; 52 3.788,4.75; 53 3.788,5.25; 54 3.788,5.75; 55 3.788,6.25; 56 3.788,6.75 | smd 3.61 x 4.7: 57 0,0
B38G3RGB = smd 0.8 x 0.5: 1 0.8,0.45; 2 0.8,-0.45; 3 -0.8,-0.45; 4 -0.8,0.45
MA06-2 = drill 1.016 octagon: 1 -6.35,-1.27; 2 -6.35,1.27; 3 -3.81,-1.27; 4 -3.81,1.27; 5 -1.27,-1.27; 6 -1.27,1.27; 7 1.27,-1.27; 8 1.27,1.27; 9 3.81,-1.27; 10 3.81,1.27; 11 6.35,-1.27; 12 6.35,1.27

### Placement (x,y rotation side)
C1  14.7,126.9 180 bottom
C2  4.65,109.07 180 bottom
C3  4.8,92.2 180 bottom
C4  4.9,75.3 180 bottom
C5  4.9,58.3 180 bottom
C6  4.7,41.4 180 bottom
C7  4.7,24.5 180 bottom
C8  14.9,8 180 bottom
C9  21.9,7.1 180 bottom  (outside the outline)
IC1  8.47,132.65 180 bottom
IC2  8.47,115.72 180 bottom
IC3  8.47,98.78 180 bottom
IC4  8.47,81.85 180 bottom
IC5  8.47,64.92 180 bottom
IC6  8.47,47.98 180 bottom
IC7  8.47,31.05 180 bottom
IC8  8.47,14.23 180 bottom
LED1  2.12,136.88 0 top
LED2  6.35,136.88 0 top
LED3  10.58,136.88 0 top
LED4  14.82,136.88 0 top
LED5  2.12,132.65 0 top
LED6  6.35,132.65 0 top
LED7  10.58,132.65 0 top
LED8  14.82,132.65 0 top
LED9  2.12,128.42 0 top
LED10  6.35,128.42 0 top
LED11  10.58,128.42 0 top
LED12  14.82,128.42 0 top
LED13  2.12,124.18 0 top
LED14  6.35,124.18 0 top
LED15  10.58,124.18 0 top
LED16  14.82,124.18 0 top
LED17  2.12,119.95 0 top
LED18  6.35,119.95 0 top
LED19  10.58,119.95 0 top
LED20  14.82,119.95 0 top
LED21  2.12,115.72 0 top
LED22  6.35,115.72 0 top
LED23  10.58,115.72 0 top
LED24  14.82,115.72 0 top
LED25  2.12,111.48 0 top
LED26  6.35,111.48 0 top
LED27  10.58,111.48 0 top
LED28  14.82,111.48 0 top
LED29  2.12,107.25 0 top
LED30  6.35,107.25 0 top
LED31  10.58,107.25 0 top
LED32  14.82,107.25 0 top
LED33  2.12,103.02 0 top
LED34  6.35,103.02 0 top
LED35  10.58,103.02 0 top
LED36  14.82,103.02 0 top
LED37  2.12,98.78 0 top
LED38  6.35,98.78 0 top
LED39  10.58,98.78 0 top
LED40  14.82,98.78 0 top
LED41  2.12,94.55 0 top
LED42  6.35,94.55 0 top
LED43  10.58,94.55 0 top
LED44  14.82,94.55 0 top
LED45  2.12,90.32 0 top
LED46  6.35,90.32 0 top
LED47  10.58,90.32 0 top
LED48  14.82,90.32 0 top
LED49  2.12,86.08 0 top
LED50  6.35,86.08 0 top
LED51  10.58,86.08 0 top
LED52  14.82,86.08 0 top
LED53  2.12,81.85 0 top
LED54  6.35,81.85 0 top
LED55  10.58,81.85 0 top
LED56  14.82,81.85 0 top
LED57  2.12,77.62 0 top
LED58  6.35,77.62 0 top
LED59  10.58,77.62 0 top
LED60  14.82,77.62 0 top
LED61  2.12,73.38 0 top
LED62  6.35,73.38 0 top
LED63  10.58,73.38 0 top
LED64  14.82,73.38 0 top
LED65  2.12,69.15 0 top
LED66  6.35,69.15 0 top
LED67  10.58,69.15 0 top
LED68  14.82,69.15 0 top
LED69  2.12,64.92 0 top
LED70  6.35,64.92 0 top
LED71  10.58,64.92 0 top
LED72  14.82,64.92 0 top
LED73  2.12,60.68 0 top
LED74  6.35,60.68 0 top
LED75  10.58,60.68 0 top
LED76  14.82,60.68 0 top
LED77  2.12,56.45 0 top
LED78  6.35,56.45 0 top
LED79  10.58,56.45 0 top
LED80  14.82,56.45 0 top
LED81  2.12,52.22 0 top
LED82  6.35,52.22 0 top
LED83  10.58,52.22 0 top
LED84  14.82,52.22 0 top
LED85  2.12,47.98 0 top
LED86  6.35,47.98 0 top
LED87  10.58,47.98 0 top
LED88  14.82,47.98 0 top
LED89  2.12,43.75 0 top
LED90  6.35,43.75 0 top
LED91  10.58,43.75 0 top
LED92  14.82,43.75 0 top
LED93  2.12,39.52 0 top
LED94  6.35,39.52 0 top
LED95  10.58,39.52 0 top
LED96  14.82,39.52 0 top
LED97  2.12,35.28 0 top
LED98  6.35,35.28 0 top
LED99  10.58,35.28 0 top
LED100  14.82,35.28 0 top
LED101  2.12,31.05 0 top
LED102  6.35,31.05 0 top
LED103  10.58,31.05 0 top
LED104  14.82,31.05 0 top
LED105  2.12,26.82 0 top
LED106  6.35,26.82 0 top
LED107  10.58,26.82 0 top
LED108  14.82,26.82 0 top
LED109  2.12,22.58 0 top
LED110  6.35,22.58 0 top
LED111  10.58,22.58 0 top
LED112  14.82,22.58 0 top
LED113  2.12,18.35 0 top
LED114  6.35,18.35 0 top
LED115  10.58,18.35 0 top
LED116  14.82,18.35 0 top
LED117  2.12,14.12 0 top
LED118  6.35,14.12 0 top
LED119  10.58,14.12 0 top
LED120  14.82,14.12 0 top
SV1  8.47,3.5 0 top

### Tracks (layer width: path | path; a pad name or v marks a point on that pad's centre or on a via)
3V3  (138 unrouted)
  pour InnerTop (no thermals): -20,166 40,166 40,-6 -20,-6
GND  (34 unrouted)
  pour InnerBottom (no thermals): -20,166 38.2,166 38.2,-3 -20,-3
GSCLK  (8 unrouted)
LAT  (8 unrouted)
N$LEDB1_IC1_PIN4  (1 unrouted)
N$LEDB2_IC1_PIN10  (1 unrouted)
N$LEDB3_IC1_PIN16  (1 unrouted)
N$LEDB4_IC1_PIN22  (1 unrouted)
N$LEDB5_IC1_PIN7  (1 unrouted)
N$LEDB6_IC1_PIN13  (1 unrouted)
N$LEDB7_IC1_PIN19  (1 unrouted)
N$LEDB8_IC1_PIN25  (1 unrouted)
N$LEDB9_IC1_PIN53  (1 unrouted)
N$LEDB10_IC1_PIN47  (1 unrouted)
N$LEDB11_IC1_PIN41  (1 unrouted)
N$LEDB12_IC1_PIN35  (1 unrouted)
N$LEDB13_IC1_PIN50  (1 unrouted)
N$LEDB14_IC1_PIN44  (1 unrouted)
N$LEDB15_IC1_PIN38  (1 unrouted)
N$LEDB16_IC1_PIN32  (1 unrouted)
N$LEDB17_IC2_PIN4  (1 unrouted)
N$LEDB18_IC2_PIN10  (1 unrouted)
N$LEDB19_IC2_PIN16  (1 unrouted)
N$LEDB20_IC2_PIN22  (1 unrouted)
N$LEDB21_IC2_PIN7  (1 unrouted)
N$LEDB22_IC2_PIN13  (1 unrouted)
N$LEDB23_IC2_PIN19  (1 unrouted)
N$LEDB24_IC2_PIN25  (1 unrouted)
N$LEDB25_IC2_PIN53  (1 unrouted)
N$LEDB26_IC2_PIN47  (1 unrouted)
N$LEDB27_IC2_PIN41  (1 unrouted)
N$LEDB28_IC2_PIN35  (1 unrouted)
N$LEDB29_IC2_PIN50  (1 unrouted)
N$LEDB30_IC2_PIN44  (1 unrouted)
N$LEDB31_IC2_PIN38  (1 unrouted)
N$LEDB32_IC2_PIN32  (1 unrouted)
N$LEDB33_IC3_PIN4  (1 unrouted)
N$LEDB34_IC3_PIN10  (1 unrouted)
N$LEDB35_IC3_PIN16  (1 unrouted)
N$LEDB36_IC3_PIN22  (1 unrouted)
N$LEDB37_IC3_PIN7  (1 unrouted)
N$LEDB38_IC3_PIN13  (1 unrouted)
N$LEDB39_IC3_PIN19  (1 unrouted)
N$LEDB40_IC3_PIN25  (1 unrouted)
N$LEDB41_IC3_PIN53  (1 unrouted)
N$LEDB42_IC3_PIN47  (1 unrouted)
N$LEDB43_IC3_PIN41  (1 unrouted)
N$LEDB44_IC3_PIN35  (1 unrouted)
N$LEDB45_IC3_PIN50  (1 unrouted)
N$LEDB46_IC3_PIN44  (1 unrouted)
N$LEDB47_IC3_PIN38  (1 unrouted)
N$LEDB48_IC3_PIN32  (1 unrouted)
N$LEDB49_IC4_PIN4  (1 unrouted)
N$LEDB50_IC4_PIN10  (1 unrouted)
N$LEDB51_IC4_PIN16  (1 unrouted)
N$LEDB52_IC4_PIN22  (1 unrouted)
N$LEDB53_IC4_PIN7  (1 unrouted)
N$LEDB54_IC4_PIN13  (1 unrouted)
N$LEDB55_IC4_PIN19  (1 unrouted)
N$LEDB56_IC4_PIN25  (1 unrouted)
N$LEDB57_IC4_PIN53  (1 unrouted)
N$LEDB58_IC4_PIN47  (1 unrouted)
N$LEDB59_IC4_PIN41  (1 unrouted)
N$LEDB60_IC4_PIN35  (1 unrouted)
N$LEDB61_IC4_PIN50  (1 unrouted)
N$LEDB62_IC4_PIN44  (1 unrouted)
N$LEDB63_IC4_PIN38  (1 unrouted)
N$LEDB64_IC4_PIN32  (1 unrouted)
N$LEDB65_IC5_PIN4  (1 unrouted)
N$LEDB66_IC5_PIN10  (1 unrouted)
N$LEDB67_IC5_PIN16  (1 unrouted)
N$LEDB68_IC5_PIN22  (1 unrouted)
N$LEDB69_IC5_PIN7  (1 unrouted)
N$LEDB70_IC5_PIN13  (1 unrouted)
N$LEDB71_IC5_PIN19  (1 unrouted)
N$LEDB72_IC5_PIN25  (1 unrouted)
N$LEDB73_IC5_PIN53  (1 unrouted)
N$LEDB74_IC5_PIN47  (1 unrouted)
N$LEDB75_IC5_PIN41  (1 unrouted)
N$LEDB76_IC5_PIN35  (1 unrouted)
N$LEDB77_IC5_PIN50  (1 unrouted)
N$LEDB78_IC5_PIN44  (1 unrouted)
N$LEDB79_IC5_PIN38  (1 unrouted)
N$LEDB80_IC5_PIN32  (1 unrouted)
N$LEDB81_IC6_PIN4  (1 unrouted)
N$LEDB82_IC6_PIN10  (1 unrouted)
N$LEDB83_IC6_PIN16  (1 unrouted)
N$LEDB84_IC6_PIN22  (1 unrouted)
N$LEDB85_IC6_PIN7  (1 unrouted)
N$LEDB86_IC6_PIN13  (1 unrouted)
N$LEDB87_IC6_PIN19  (1 unrouted)
N$LEDB88_IC6_PIN25  (1 unrouted)
N$LEDB89_IC6_PIN53  (1 unrouted)
N$LEDB90_IC6_PIN47  (1 unrouted)
N$LEDB91_IC6_PIN41  (1 unrouted)
N$LEDB92_IC6_PIN35  (1 unrouted)
N$LEDB93_IC6_PIN50  (1 unrouted)
N$LEDB94_IC6_PIN44  (1 unrouted)
N$LEDB95_IC6_PIN38  (1 unrouted)
N$LEDB96_IC6_PIN32  (1 unrouted)
N$LEDB97_IC7_PIN4  (1 unrouted)
N$LEDB98_IC7_PIN10  (1 unrouted)
N$LEDB99_IC7_PIN16  (1 unrouted)
N$LEDB100_IC7_PIN22  (1 unrouted)
N$LEDB101_IC7_PIN7  (1 unrouted)
N$LEDB102_IC7_PIN13  (1 unrouted)
N$LEDB103_IC7_PIN19  (1 unrouted)
N$LEDB104_IC7_PIN25  (1 unrouted)
N$LEDB105_IC7_PIN53  (1 unrouted)
N$LEDB106_IC7_PIN47  (1 unrouted)
N$LEDB107_IC7_PIN41  (1 unrouted)
N$LEDB108_IC7_PIN35  (1 unrouted)
N$LEDB109_IC7_PIN50  (1 unrouted)
N$LEDB110_IC7_PIN44  (1 unrouted)
N$LEDB111_IC7_PIN38  (1 unrouted)
N$LEDB112_IC7_PIN32  (1 unrouted)
N$LEDB113_IC8_PIN4  (1 unrouted)
N$LEDB114_IC8_PIN10  (1 unrouted)
N$LEDB115_IC8_PIN16  (1 unrouted)
N$LEDB116_IC8_PIN22  (1 unrouted)
N$LEDB117_IC8_PIN7  (1 unrouted)
N$LEDB118_IC8_PIN13  (1 unrouted)
N$LEDB119_IC8_PIN19  (1 unrouted)
N$LEDB120_IC8_PIN25  (1 unrouted)
N$LEDG1_IC1_PIN6  (1 unrouted)
N$LEDG2_IC1_PIN12  (1 unrouted)
N$LEDG3_IC1_PIN18  (1 unrouted)
N$LEDG4_IC1_PIN24  (1 unrouted)
N$LEDG5_IC1_PIN9  (1 unrouted)
N$LEDG6_IC1_PIN15  (1 unrouted)
N$LEDG7_IC1_PIN21  (1 unrouted)
N$LEDG8_IC1_PIN27  (1 unrouted)
N$LEDG9_IC1_PIN51  (1 unrouted)
N$LEDG10_IC1_PIN45  (1 unrouted)
N$LEDG11_IC1_PIN39  (1 unrouted)
N$LEDG12_IC1_PIN33  (1 unrouted)
N$LEDG13_IC1_PIN48  (1 unrouted)
N$LEDG14_IC1_PIN42  (1 unrouted)
N$LEDG15_IC1_PIN36  (1 unrouted)
N$LEDG16_IC1_PIN30  (1 unrouted)
N$LEDG17_IC2_PIN6  (1 unrouted)
N$LEDG18_IC2_PIN12  (1 unrouted)
N$LEDG19_IC2_PIN18  (1 unrouted)
N$LEDG20_IC2_PIN24  (1 unrouted)
N$LEDG21_IC2_PIN9  (1 unrouted)
N$LEDG22_IC2_PIN15  (1 unrouted)
N$LEDG23_IC2_PIN21  (1 unrouted)
N$LEDG24_IC2_PIN27  (1 unrouted)
N$LEDG25_IC2_PIN51  (1 unrouted)
N$LEDG26_IC2_PIN45  (1 unrouted)
N$LEDG27_IC2_PIN39  (1 unrouted)
N$LEDG28_IC2_PIN33  (1 unrouted)
N$LEDG29_IC2_PIN48  (1 unrouted)
N$LEDG30_IC2_PIN42  (1 unrouted)
N$LEDG31_IC2_PIN36  (1 unrouted)
N$LEDG32_IC2_PIN30  (1 unrouted)
N$LEDG33_IC3_PIN6  (1 unrouted)
N$LEDG34_IC3_PIN12  (1 unrouted)
N$LEDG35_IC3_PIN18  (1 unrouted)
N$LEDG36_IC3_PIN24  (1 unrouted)
N$LEDG37_IC3_PIN9  (1 unrouted)
N$LEDG38_IC3_PIN15  (1 unrouted)
N$LEDG39_IC3_PIN21  (1 unrouted)
N$LEDG40_IC3_PIN27  (1 unrouted)
N$LEDG41_IC3_PIN51  (1 unrouted)
N$LEDG42_IC3_PIN45  (1 unrouted)
N$LEDG43_IC3_PIN39  (1 unrouted)
N$LEDG44_IC3_PIN33  (1 unrouted)
N$LEDG45_IC3_PIN48  (1 unrouted)
N$LEDG46_IC3_PIN42  (1 unrouted)
N$LEDG47_IC3_PIN36  (1 unrouted)
N$LEDG48_IC3_PIN30  (1 unrouted)
N$LEDG49_IC4_PIN6  (1 unrouted)
N$LEDG50_IC4_PIN12  (1 unrouted)
N$LEDG51_IC4_PIN18  (1 unrouted)
N$LEDG52_IC4_PIN24  (1 unrouted)
N$LEDG53_IC4_PIN9  (1 unrouted)
N$LEDG54_IC4_PIN15  (1 unrouted)
N$LEDG55_IC4_PIN21  (1 unrouted)
N$LEDG56_IC4_PIN27  (1 unrouted)
N$LEDG57_IC4_PIN51  (1 unrouted)
N$LEDG58_IC4_PIN45  (1 unrouted)
N$LEDG59_IC4_PIN39  (1 unrouted)
N$LEDG60_IC4_PIN33  (1 unrouted)
N$LEDG61_IC4_PIN48  (1 unrouted)
N$LEDG62_IC4_PIN42  (1 unrouted)
N$LEDG63_IC4_PIN36  (1 unrouted)
N$LEDG64_IC4_PIN30  (1 unrouted)
N$LEDG65_IC5_PIN6  (1 unrouted)
N$LEDG66_IC5_PIN12  (1 unrouted)
N$LEDG67_IC5_PIN18  (1 unrouted)
N$LEDG68_IC5_PIN24  (1 unrouted)
N$LEDG69_IC5_PIN9  (1 unrouted)
N$LEDG70_IC5_PIN15  (1 unrouted)
N$LEDG71_IC5_PIN21  (1 unrouted)
N$LEDG72_IC5_PIN27  (1 unrouted)
N$LEDG73_IC5_PIN51  (1 unrouted)
N$LEDG74_IC5_PIN45  (1 unrouted)
N$LEDG75_IC5_PIN39  (1 unrouted)
N$LEDG76_IC5_PIN33  (1 unrouted)
N$LEDG77_IC5_PIN48  (1 unrouted)
N$LEDG78_IC5_PIN42  (1 unrouted)
N$LEDG79_IC5_PIN36  (1 unrouted)
N$LEDG80_IC5_PIN30  (1 unrouted)
N$LEDG81_IC6_PIN6  (1 unrouted)
N$LEDG82_IC6_PIN12  (1 unrouted)
N$LEDG83_IC6_PIN18  (1 unrouted)
N$LEDG84_IC6_PIN24  (1 unrouted)
N$LEDG85_IC6_PIN9  (1 unrouted)
N$LEDG86_IC6_PIN15  (1 unrouted)
N$LEDG87_IC6_PIN21  (1 unrouted)
N$LEDG88_IC6_PIN27  (1 unrouted)
N$LEDG89_IC6_PIN51  (1 unrouted)
N$LEDG90_IC6_PIN45  (1 unrouted)
N$LEDG91_IC6_PIN39  (1 unrouted)
N$LEDG92_IC6_PIN33  (1 unrouted)
N$LEDG93_IC6_PIN48  (1 unrouted)
N$LEDG94_IC6_PIN42  (1 unrouted)
N$LEDG95_IC6_PIN36  (1 unrouted)
N$LEDG96_IC6_PIN30  (1 unrouted)
N$LEDG97_IC7_PIN6  (1 unrouted)
N$LEDG98_IC7_PIN12  (1 unrouted)
N$LEDG99_IC7_PIN18  (1 unrouted)
N$LEDG100_IC7_PIN24  (1 unrouted)
N$LEDG101_IC7_PIN9  (1 unrouted)
N$LEDG102_IC7_PIN15  (1 unrouted)
N$LEDG103_IC7_PIN21  (1 unrouted)
N$LEDG104_IC7_PIN27  (1 unrouted)
N$LEDG105_IC7_PIN51  (1 unrouted)
N$LEDG106_IC7_PIN45  (1 unrouted)
N$LEDG107_IC7_PIN39  (1 unrouted)
N$LEDG108_IC7_PIN33  (1 unrouted)
N$LEDG109_IC7_PIN48  (1 unrouted)
N$LEDG110_IC7_PIN42  (1 unrouted)
N$LEDG111_IC7_PIN36  (1 unrouted)
N$LEDG112_IC7_PIN30  (1 unrouted)
N$LEDG113_IC8_PIN6  (1 unrouted)
N$LEDG114_IC8_PIN12  (1 unrouted)
N$LEDG115_IC8_PIN18  (1 unrouted)
N$LEDG116_IC8_PIN24  (1 unrouted)
N$LEDG117_IC8_PIN9  (1 unrouted)
N$LEDG118_IC8_PIN15  (1 unrouted)
N$LEDG119_IC8_PIN21  (1 unrouted)
N$LEDG120_IC8_PIN27  (1 unrouted)
N$LEDR1_IC1_PIN5  (1 unrouted)
N$LEDR2_IC1_PIN11  (1 unrouted)
N$LEDR3_IC1_PIN17  (1 unrouted)
N$LEDR4_IC1_PIN23  (1 unrouted)
N$LEDR5_IC1_PIN8  (1 unrouted)
N$LEDR6_IC1_PIN14  (1 unrouted)
N$LEDR7_IC1_PIN20  (1 unrouted)
N$LEDR8_IC1_PIN26  (1 unrouted)
N$LEDR9_IC1_PIN52  (1 unrouted)
N$LEDR10_IC1_PIN46  (1 unrouted)
N$LEDR11_IC1_PIN40  (1 unrouted)
N$LEDR12_IC1_PIN34  (1 unrouted)
N$LEDR13_IC1_PIN49  (1 unrouted)
N$LEDR14_IC1_PIN43  (1 unrouted)
N$LEDR15_IC1_PIN37  (1 unrouted)
N$LEDR16_IC1_PIN31  (1 unrouted)
N$LEDR17_IC2_PIN5  (1 unrouted)
N$LEDR18_IC2_PIN11  (1 unrouted)
N$LEDR19_IC2_PIN17  (1 unrouted)
N$LEDR20_IC2_PIN23  (1 unrouted)
N$LEDR21_IC2_PIN8  (1 unrouted)
N$LEDR22_IC2_PIN14  (1 unrouted)
N$LEDR23_IC2_PIN20  (1 unrouted)
N$LEDR24_IC2_PIN26  (1 unrouted)
N$LEDR25_IC2_PIN52  (1 unrouted)
N$LEDR26_IC2_PIN46  (1 unrouted)
N$LEDR27_IC2_PIN40  (1 unrouted)
N$LEDR28_IC2_PIN34  (1 unrouted)
N$LEDR29_IC2_PIN49  (1 unrouted)
N$LEDR30_IC2_PIN43  (1 unrouted)
N$LEDR31_IC2_PIN37  (1 unrouted)
N$LEDR32_IC2_PIN31  (1 unrouted)
N$LEDR33_IC3_PIN5  (1 unrouted)
N$LEDR34_IC3_PIN11  (1 unrouted)
N$LEDR35_IC3_PIN17  (1 unrouted)
N$LEDR36_IC3_PIN23  (1 unrouted)
N$LEDR37_IC3_PIN8  (1 unrouted)
N$LEDR38_IC3_PIN14  (1 unrouted)
N$LEDR39_IC3_PIN20  (1 unrouted)
N$LEDR40_IC3_PIN26  (1 unrouted)
N$LEDR41_IC3_PIN52  (1 unrouted)
N$LEDR42_IC3_PIN46  (1 unrouted)
N$LEDR43_IC3_PIN40  (1 unrouted)
N$LEDR44_IC3_PIN34  (1 unrouted)
N$LEDR45_IC3_PIN49  (1 unrouted)
N$LEDR46_IC3_PIN43  (1 unrouted)
N$LEDR47_IC3_PIN37  (1 unrouted)
N$LEDR48_IC3_PIN31  (1 unrouted)
N$LEDR49_IC4_PIN5  (1 unrouted)
N$LEDR50_IC4_PIN11  (1 unrouted)
N$LEDR51_IC4_PIN17  (1 unrouted)
N$LEDR52_IC4_PIN23  (1 unrouted)
N$LEDR53_IC4_PIN8  (1 unrouted)
N$LEDR54_IC4_PIN14  (1 unrouted)
N$LEDR55_IC4_PIN20  (1 unrouted)
N$LEDR56_IC4_PIN26  (1 unrouted)
N$LEDR57_IC4_PIN52  (1 unrouted)
N$LEDR58_IC4_PIN46  (1 unrouted)
N$LEDR59_IC4_PIN40  (1 unrouted)
N$LEDR60_IC4_PIN34  (1 unrouted)
N$LEDR61_IC4_PIN49  (1 unrouted)
N$LEDR62_IC4_PIN43  (1 unrouted)
N$LEDR63_IC4_PIN37  (1 unrouted)
N$LEDR64_IC4_PIN31  (1 unrouted)
N$LEDR65_IC5_PIN5  (1 unrouted)
N$LEDR66_IC5_PIN11  (1 unrouted)
N$LEDR67_IC5_PIN17  (1 unrouted)
N$LEDR68_IC5_PIN23  (1 unrouted)
N$LEDR69_IC5_PIN8  (1 unrouted)
N$LEDR70_IC5_PIN14  (1 unrouted)
N$LEDR71_IC5_PIN20  (1 unrouted)
N$LEDR72_IC5_PIN26  (1 unrouted)
N$LEDR73_IC5_PIN52  (1 unrouted)
N$LEDR74_IC5_PIN46  (1 unrouted)
N$LEDR75_IC5_PIN40  (1 unrouted)
N$LEDR76_IC5_PIN34  (1 unrouted)
N$LEDR77_IC5_PIN49  (1 unrouted)
N$LEDR78_IC5_PIN43  (1 unrouted)
N$LEDR79_IC5_PIN37  (1 unrouted)
N$LEDR80_IC5_PIN31  (1 unrouted)
N$LEDR81_IC6_PIN5  (1 unrouted)
N$LEDR82_IC6_PIN11  (1 unrouted)
N$LEDR83_IC6_PIN17  (1 unrouted)
N$LEDR84_IC6_PIN23  (1 unrouted)
N$LEDR85_IC6_PIN8  (1 unrouted)
N$LEDR86_IC6_PIN14  (1 unrouted)
N$LEDR87_IC6_PIN20  (1 unrouted)
N$LEDR88_IC6_PIN26  (1 unrouted)
N$LEDR89_IC6_PIN52  (1 unrouted)
N$LEDR90_IC6_PIN46  (1 unrouted)
N$LEDR91_IC6_PIN40  (1 unrouted)
N$LEDR92_IC6_PIN34  (1 unrouted)
N$LEDR93_IC6_PIN49  (1 unrouted)
N$LEDR94_IC6_PIN43  (1 unrouted)
N$LEDR95_IC6_PIN37  (1 unrouted)
N$LEDR96_IC6_PIN31  (1 unrouted)
N$LEDR97_IC7_PIN5  (1 unrouted)
N$LEDR98_IC7_PIN11  (1 unrouted)
N$LEDR99_IC7_PIN17  (1 unrouted)
N$LEDR100_IC7_PIN23  (1 unrouted)
N$LEDR101_IC7_PIN8  (1 unrouted)
N$LEDR102_IC7_PIN14  (1 unrouted)
N$LEDR103_IC7_PIN20  (1 unrouted)
N$LEDR104_IC7_PIN26  (1 unrouted)
N$LEDR105_IC7_PIN52  (1 unrouted)
N$LEDR106_IC7_PIN46  (1 unrouted)
N$LEDR107_IC7_PIN40  (1 unrouted)
N$LEDR108_IC7_PIN34  (1 unrouted)
N$LEDR109_IC7_PIN49  (1 unrouted)
N$LEDR110_IC7_PIN43  (1 unrouted)
N$LEDR111_IC7_PIN37  (1 unrouted)
N$LEDR112_IC7_PIN31  (1 unrouted)
N$LEDR113_IC8_PIN5  (1 unrouted)
N$LEDR114_IC8_PIN11  (1 unrouted)
N$LEDR115_IC8_PIN17  (1 unrouted)
N$LEDR116_IC8_PIN23  (1 unrouted)
N$LEDR117_IC8_PIN8  (1 unrouted)
N$LEDR118_IC8_PIN14  (1 unrouted)
N$LEDR119_IC8_PIN20  (1 unrouted)
N$LEDR120_IC8_PIN26  (1 unrouted)
SCLK  (8 unrouted)
SIN_1,2  (1 unrouted)
SIN_3,4  (1 unrouted)
SIN_5,6  (1 unrouted)
SIN_7,8  (1 unrouted)
SOUT2  (1 unrouted)
SOUT4  (1 unrouted)
SOUT6  (1 unrouted)
SOUT8  (1 unrouted)

### Text on the board
bNames: Voxel / High Density / LED Submatrix / rev 1 | IC1 | IC2 | IC3 | IC4 | IC5 | IC6 | IC7 | IC8